# EAGLE design barometer (EAGLE 9.2.2)

## Sheet 1 of 9: Table of Contents
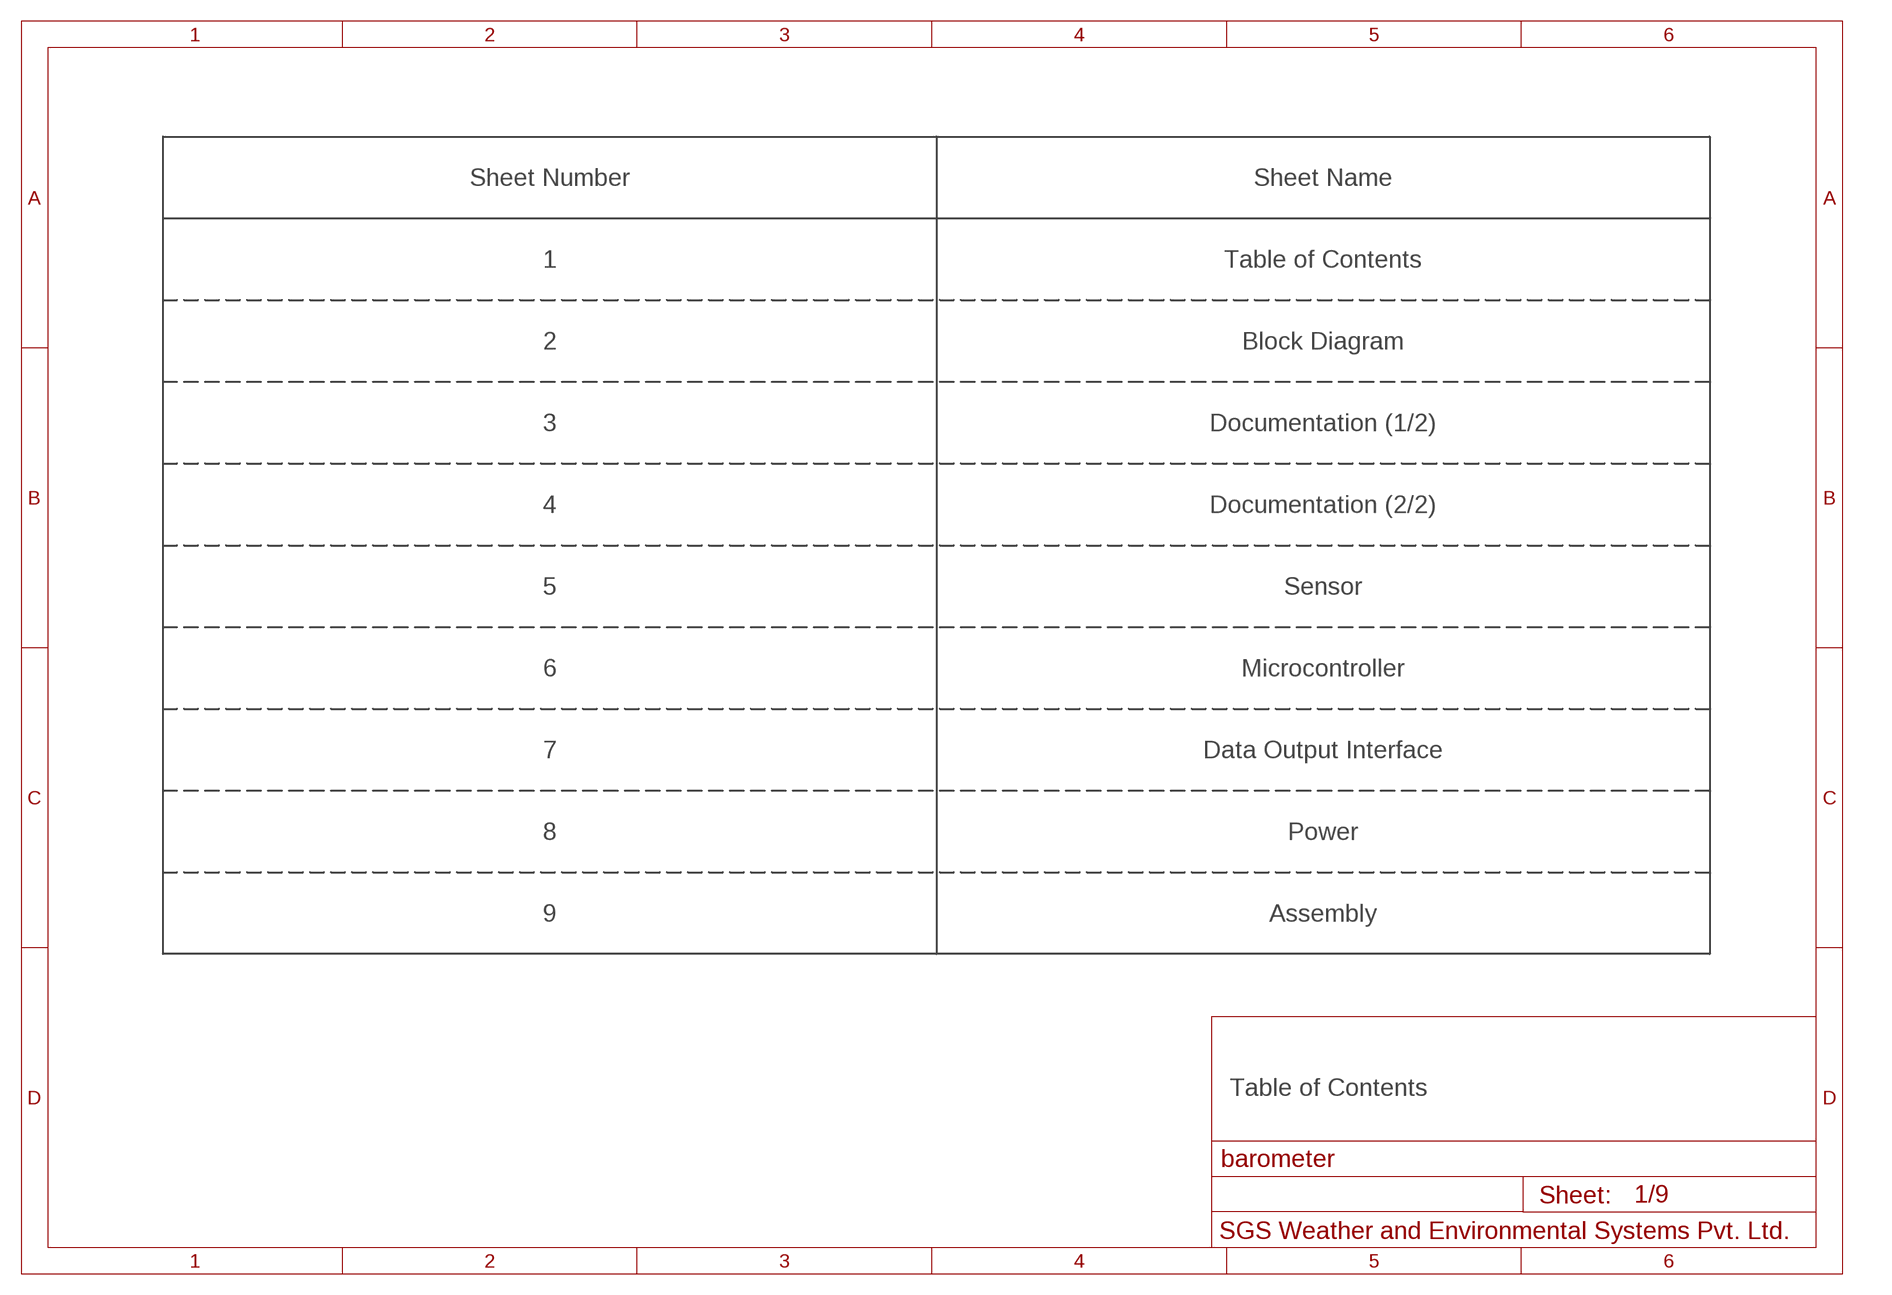
[diagram p0: schematic, sheet 1]

### Notes on the sheet
- Sheet Number | Sheet Name
- 1 | Table of Contents
- 2 | Block Diagram
- 3 | Documentation (1/2)
- 4 | Documentation (2/2)
- 5 | Sensor
- 6 | Microcontroller
- 7 | Data Output Interface
- 8 | Power
- 9 | Assembly
- Table of Contents

## Sheet 2 of 9: Block Diagram
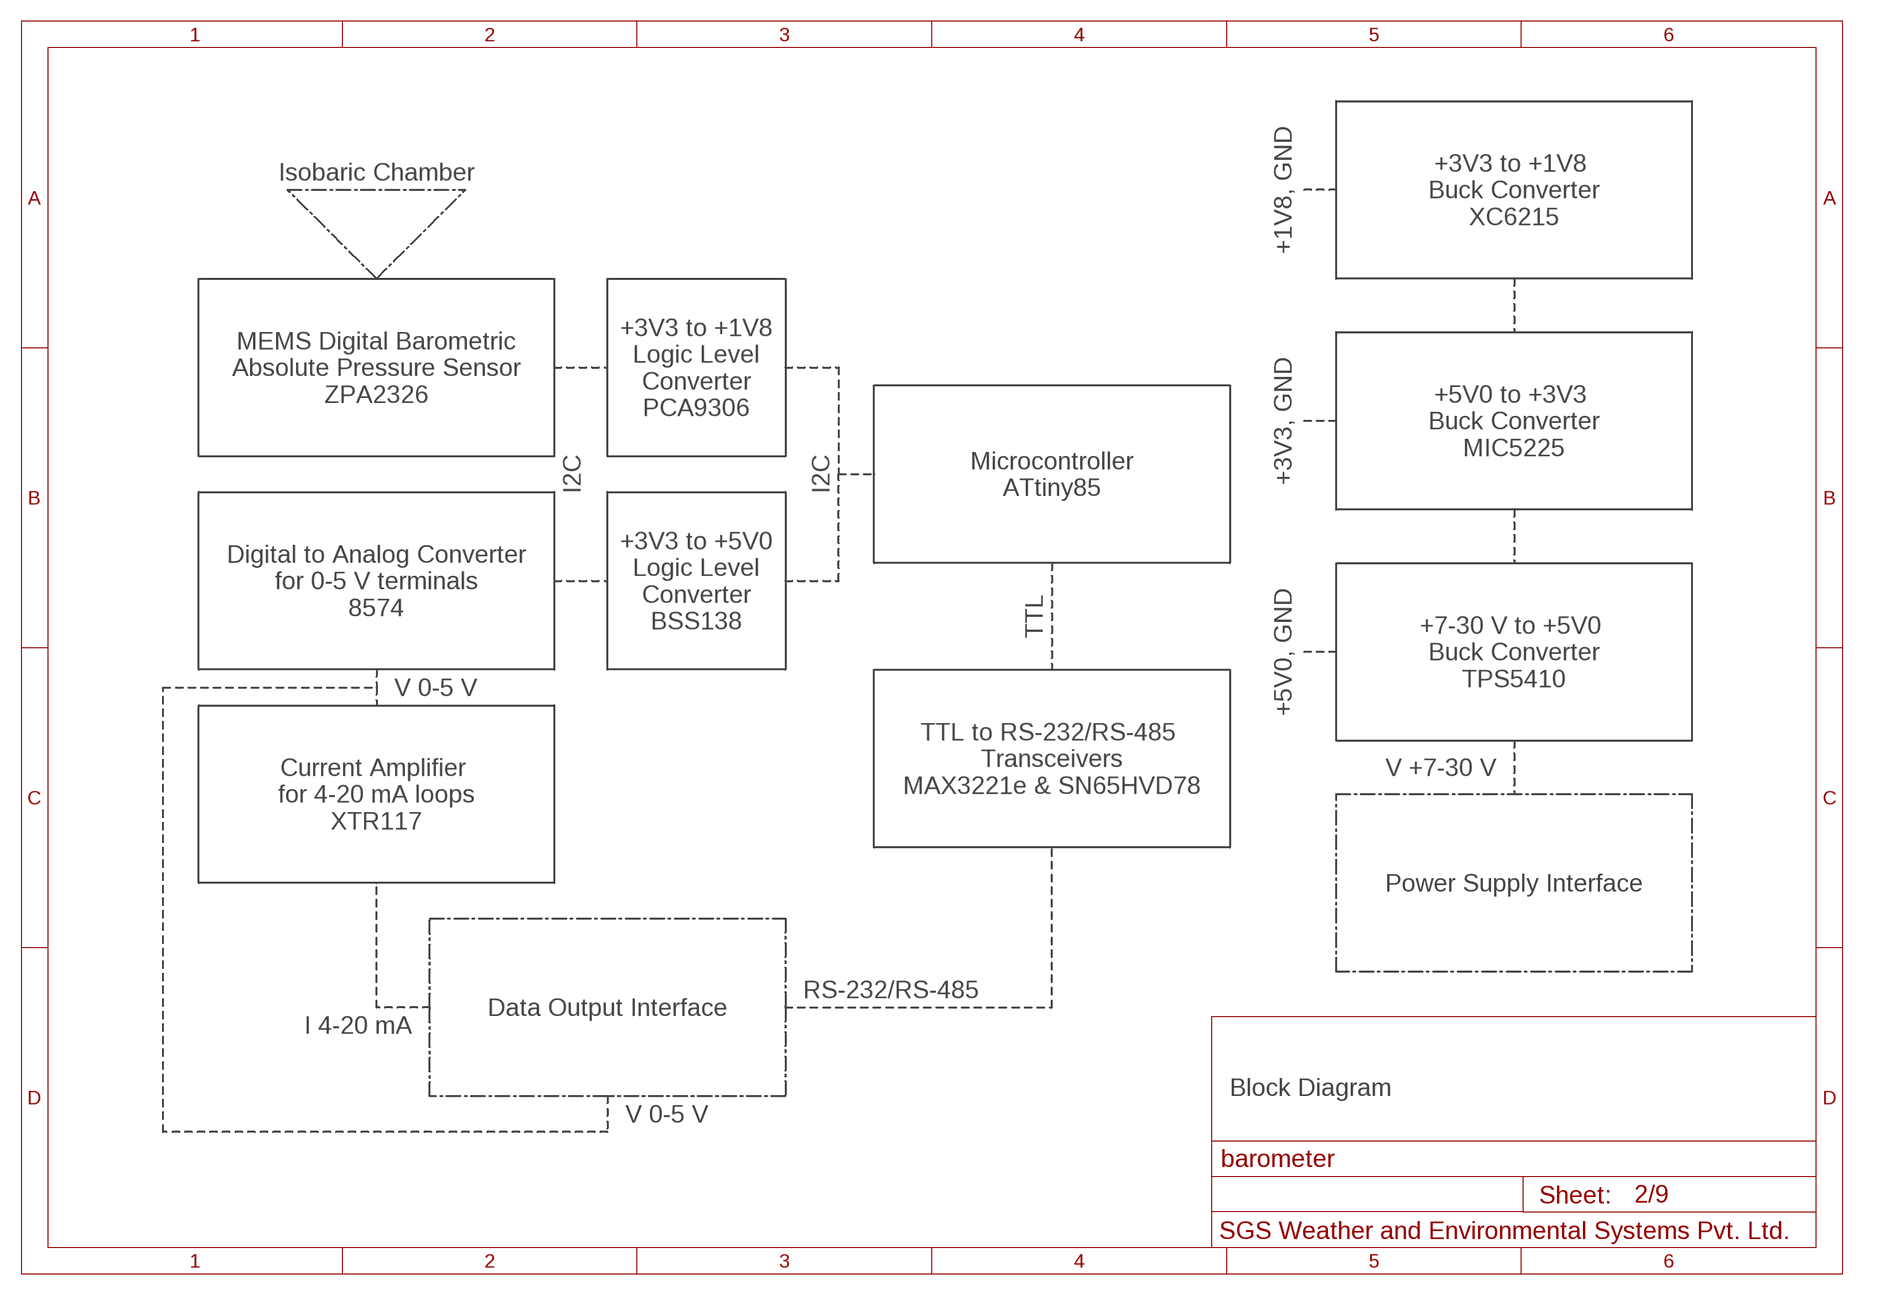
[diagram p1: schematic, sheet 2]

### Notes on the sheet
- Isobaric Chamber
- +1V8, GND
- +3V3 to +1V8 
  Buck Converter
  XC6215
- MEMS Digital Barometric
  Absolute Pressure Sensor
  ZPA2326
- +3V3 to +1V8
  Logic Level
  Converter
  PCA9306
- +3V3, GND
- +5V0 to +3V3 
  Buck Converter
  MIC5225
- I2C | I2C
- Microcontroller
  ATtiny85
- Digital to Analog Converter
  for 0-5 V terminals
  8574
- +3V3 to +5V0
  Logic Level
  Converter
  BSS138
- TTL
- +5V0, GND
- +7-30 V to +5V0 
  Buck Converter
  TPS5410
- V 0-5 V
- TTL to RS-232/RS-485 
  Transceivers
  MAX3221e & SN65HVD78
- V +7-30 V
- Current Amplifier 
  for 4-20 mA loops
  XTR117
- Power Supply Interface
- RS-232/RS-485
- Data Output Interface
- I 4-20 mA
- Block Diagram
- V 0-5 V

## Sheet 3 of 9: Documentation
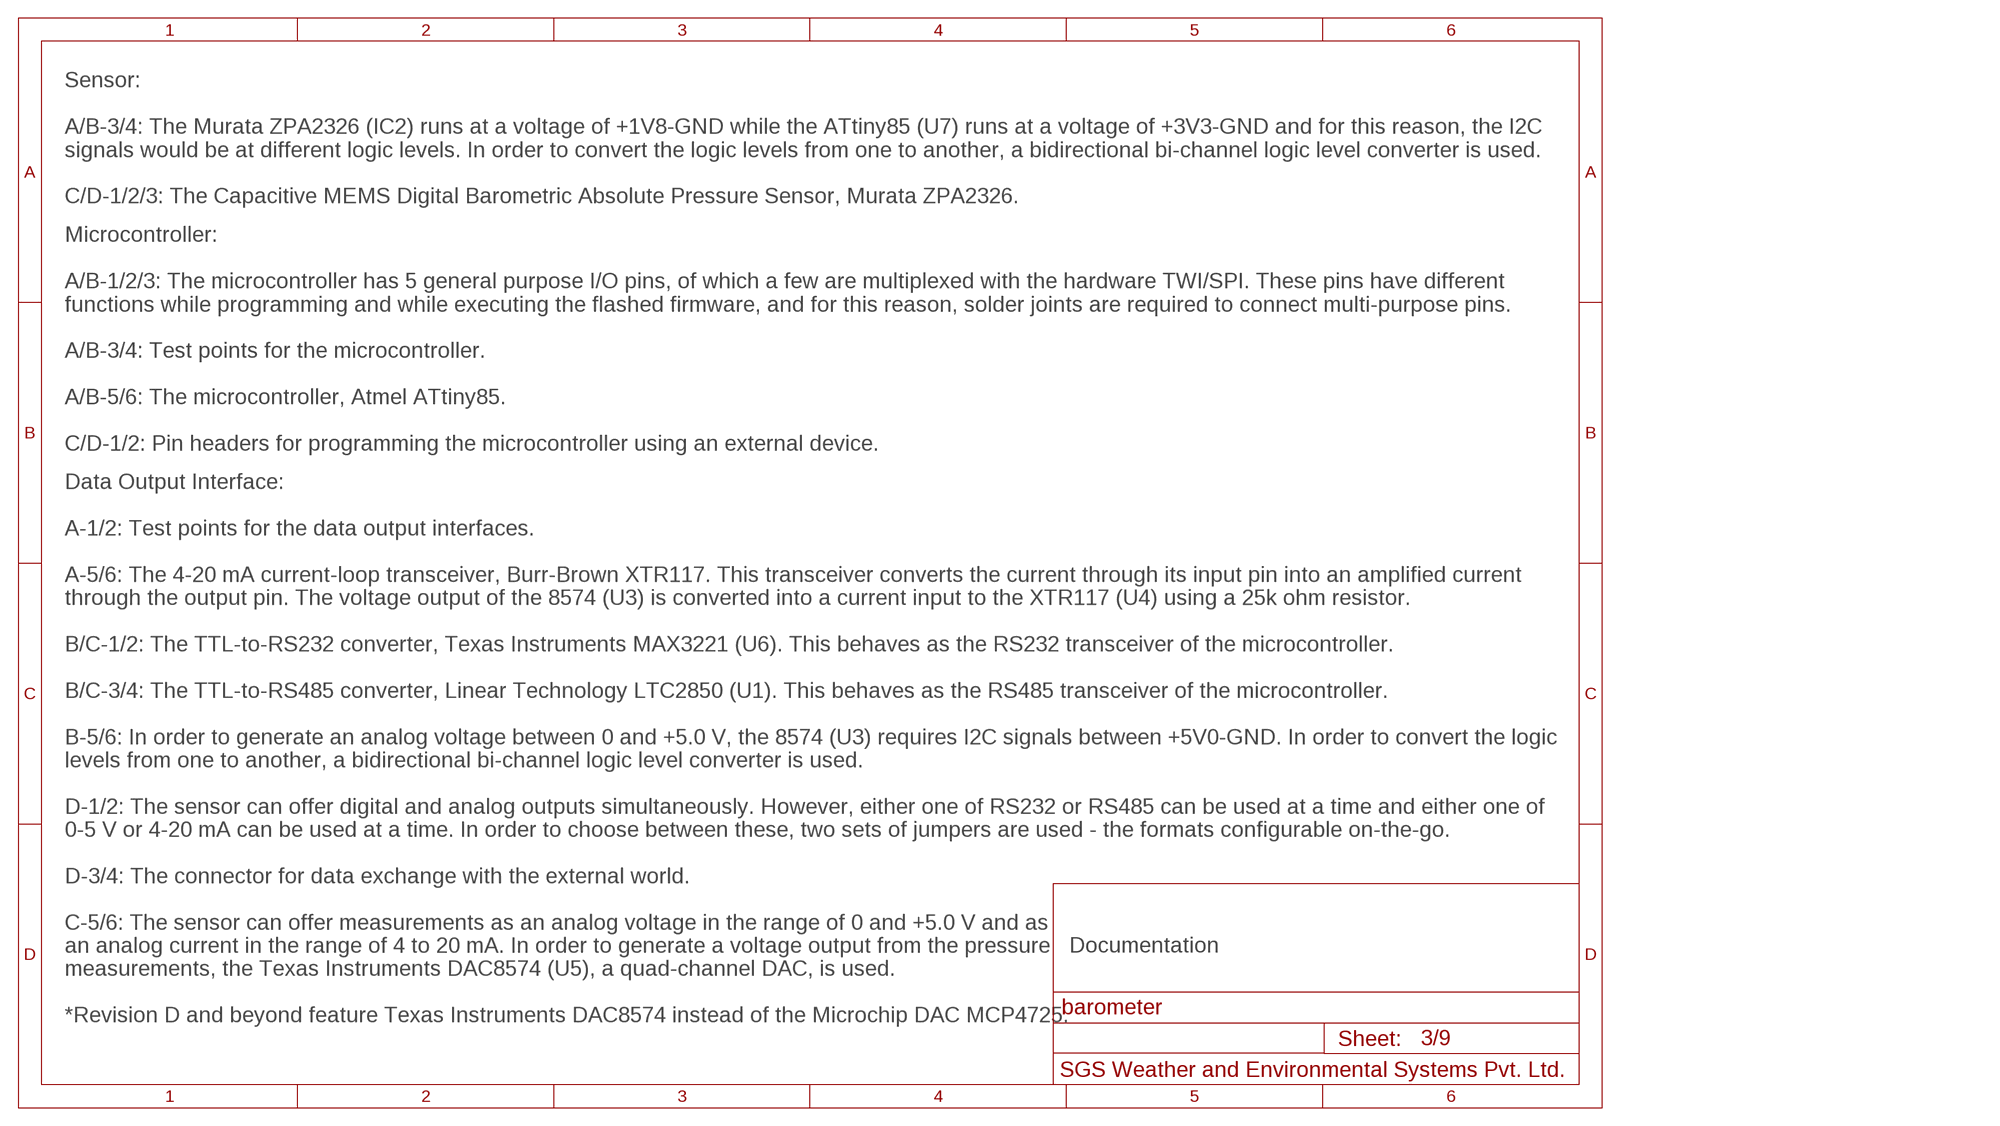
[diagram p2: schematic, sheet 3]

### Notes on the sheet
- Sensor:
  
  A/B-3/4: The Murata ZPA2326 (IC2) runs at a voltage of +1V8-GND while the ATtiny85 (U7) runs at a voltage of +3V3-GND and for this reason, the I2C 
  signals would be at different logic levels. In order to convert the logic levels from one to another, a bidirectional bi-channel logic level converter is used.
  
  C/D-1/2/3: The Capacitive MEMS Digital Barometric Absolute Pressure Sensor, Murata ZPA2326.
- Microcontroller:
  
  A/B-1/2/3: The microcontroller has 5 general purpose I/O pins, of which a few are multiplexed with the hardware TWI/SPI. These pins have different 
  functions while programming and while executing the flashed firmware, and for this reason, solder joints are required to connect multi-purpose pins.
  
  A/B-3/4: Test points for the microcontroller.
  
  A/B-5/6: The microcontroller, Atmel ATtiny85.
  
  C/D-1/2: Pin headers for programming the microcontroller using an external device.
- Data Output Interface:
  
  A-1/2: Test points for the data output interfaces.
  
  A-5/6: The 4-20 mA current-loop transceiver, Burr-Brown XTR117. This transceiver converts the current through its input pin into an amplified current 
  through the output pin. The voltage output of the 8574 (U3) is converted into a current input to the XTR117 (U4) using a 25k ohm resistor.
  
  B/C-1/2: The TTL-to-RS232 converter, Texas Instruments MAX3221 (U6). This behaves as the RS232 transceiver of the microcontroller.
  
  B/C-3/4: The TTL-to-RS485 converter, Linear Technology LTC2850 (U1). This behaves as the RS485 transceiver of the microcontroller.
  
  B-5/6: In order to generate an analog voltage between 0 and +5.0 V, the 8574 (U3) requires I2C signals between +5V0-GND. In order to convert the logic 
  levels from one to another, a bidirectional bi-channel logic level converter is used.
  
  D-1/2: The sensor can offer digital and analog outputs simultaneously. However, either one of RS232 or RS485 can be used at a time and either one of 
  0-5 V or 4-20 mA can be used at a time. In order to choose between these, two sets of jumpers are used - the formats configurable on-the-go.
  
  D-3/4: The connector for data exchange with the external world.
  
  C-5/6: The sensor can offer measurements as an analog voltage in the range of 0 and +5.0 V and as 
  an analog current in the range of 4 to 20 mA. In order to generate a voltage output from the pressure 
  measurements, the Texas Instruments DAC8574 (U5), a quad-channel DAC, is used.
  
  *Revision D and beyond feature Texas Instruments DAC8574 instead of the Microchip DAC MCP4725.
- Documentation

## Sheet 4 of 9: Documentation
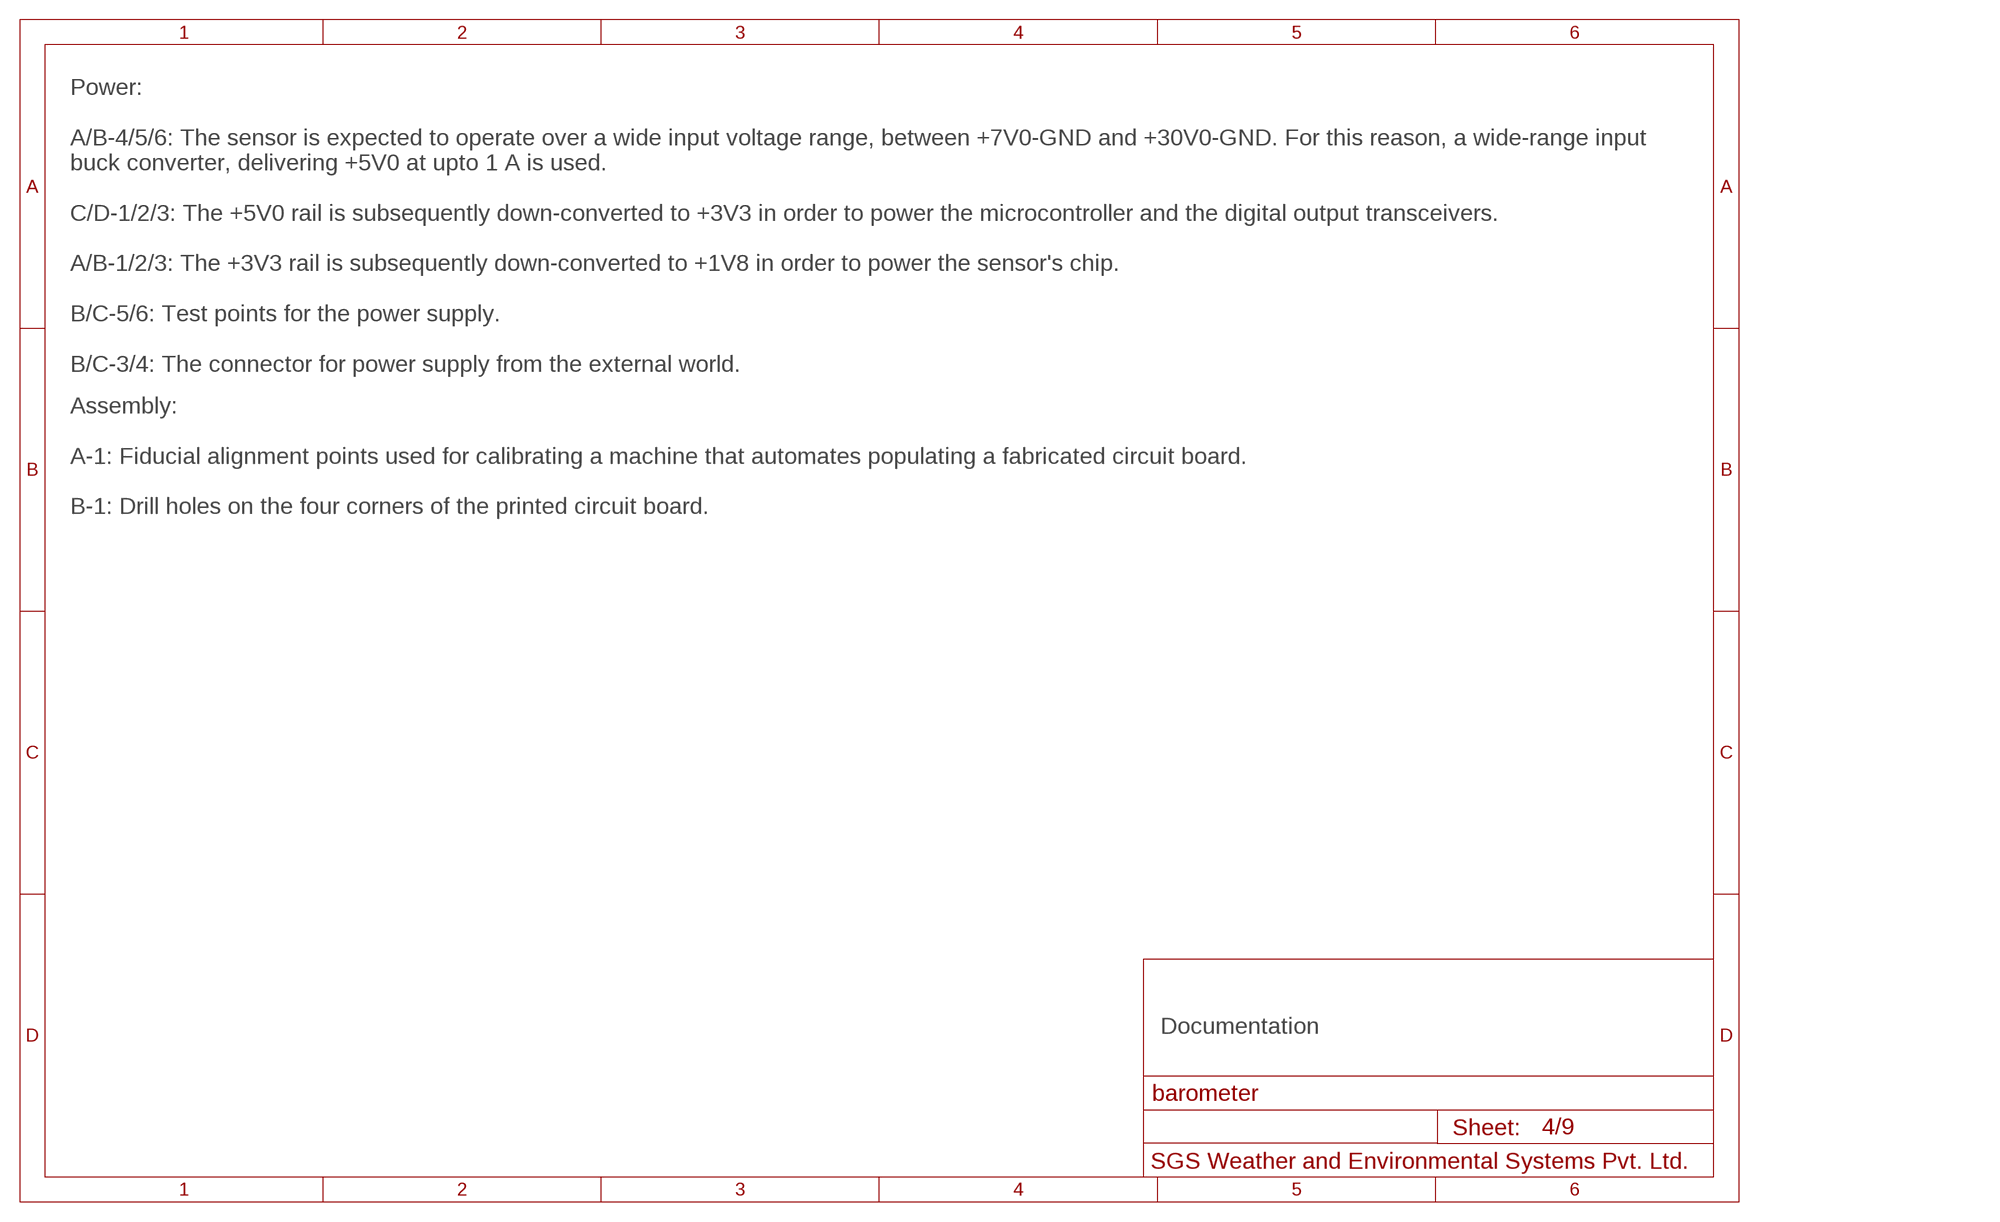
[diagram p3: schematic, sheet 4]

### Notes on the sheet
- Power:
  
  A/B-4/5/6: The sensor is expected to operate over a wide input voltage range, between +7V0-GND and +30V0-GND. For this reason, a wide-range input 
  buck converter, delivering +5V0 at upto 1 A is used.
  
  C/D-1/2/3: The +5V0 rail is subsequently down-converted to +3V3 in order to power the microcontroller and the digital output transceivers.
  
  A/B-1/2/3: The +3V3 rail is subsequently down-converted to +1V8 in order to power the sensor's chip.
  
  B/C-5/6: Test points for the power supply.
  
  B/C-3/4: The connector for power supply from the external world.
- Assembly:
  
  A-1: Fiducial alignment points used for calibrating a machine that automates populating a fabricated circuit board.
  
  B-1: Drill holes on the four corners of the printed circuit board.
- Documentation

## Sheet 5 of 9: Sensor
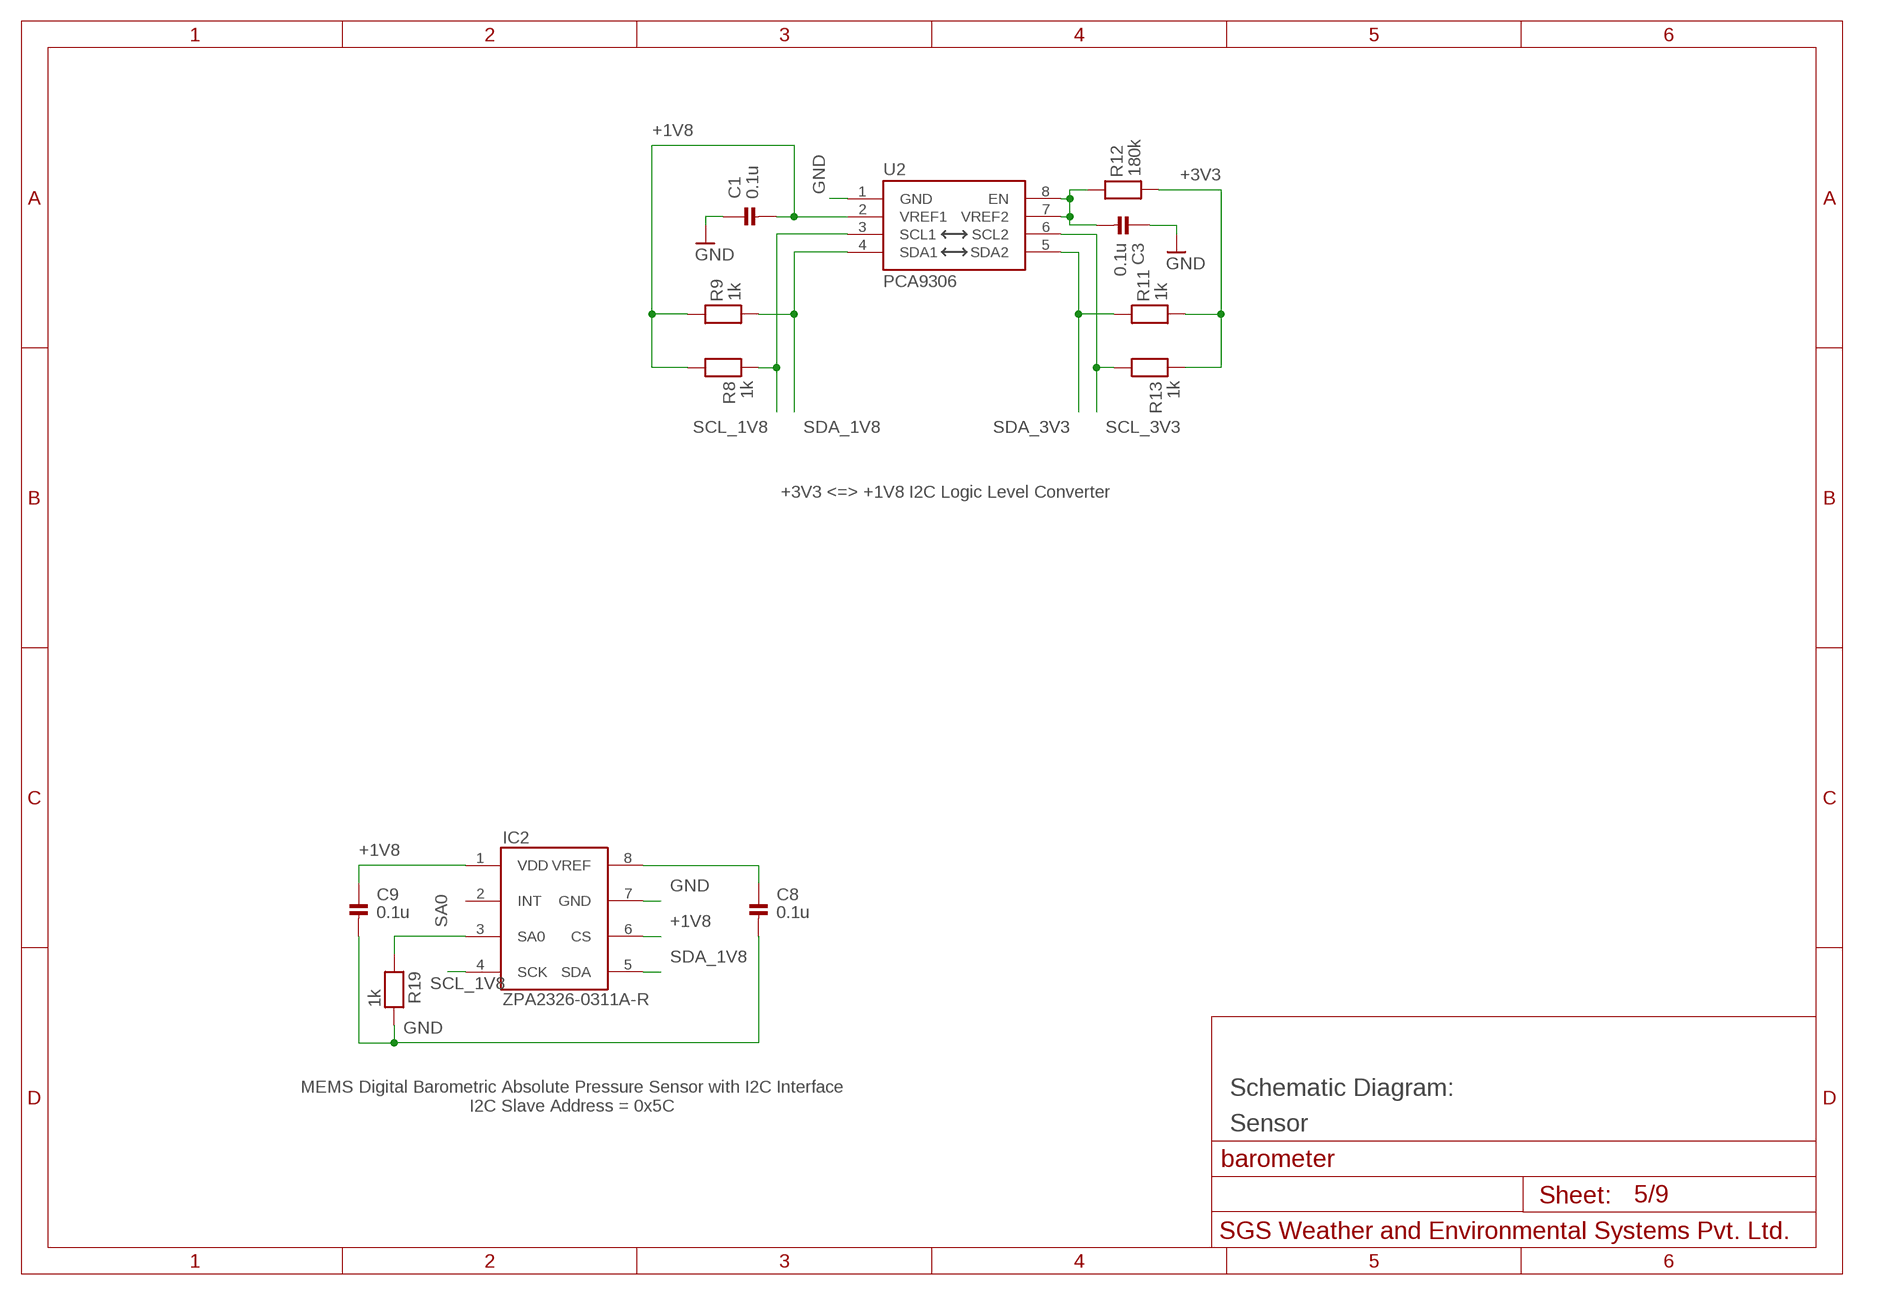
[diagram p4: schematic, sheet 5]

### Parts
C1  0.1u  CAP_CERAMIC0603  [0603]
C3  0.1u  CAP_CERAMIC0603  [0603]
C8  0.1u  CAP_CERAMIC0603  [0603]
C9  0.1u  CAP_CERAMIC0603  [0603]
IC2  ZPA2326-0311A-R  [2326]
R8  1k  RESISTOR0603  [0603]
R9  1k  RESISTOR0603  [0603]
R11  1k  RESISTOR0603  [0603]
R12  180k  RESISTOR0603  [0603]
R13  1k  RESISTOR0603  [0603]
R19  1k  RESISTOR0603  [0603]
U2  PCA9306  [PSOP-8]

### Nets
+1V8: C1.2 C9.1 IC2.1(VDD) IC2.6(CS) R8.2 R9.2 U2.2(VREF1) ; also sheet 8
+3V3: R11.1 R12.1 R13.1 ; also sheet 6,7,8
GND: C1.1 C3.1 C8.2 C9.2 IC2.7(GND) R19.2 U2.1(GND) ; also sheet 6,7,8
SA0: IC2.3(SA0) R19.1
SCL_1V8: IC2.4(SCK) R8.1 U2.3(SCL1)
SCL_3V3: R13.2 U2.6(SCL2) ; also sheet 6,7
SDA_1V8: IC2.5(SDA) R9.1 U2.4(SDA1)
SDA_3V3: R11.2 U2.5(SDA2) ; also sheet 6,7
VREF: C8.1 IC2.8(VREF)
VREF_3V3: C3.2 R12.2 U2.7(VREF2) U2.8(EN)
Unconnected: IC2.2(INT)

### Notes on the sheet
- +3V3 <=> +1V8 I2C Logic Level Converter
- MEMS Digital Barometric Absolute Pressure Sensor with I2C Interface
  I2C Slave Address = 0x5C
- Schematic Diagram:
- Sensor

## Sheet 6 of 9: Microcontroller
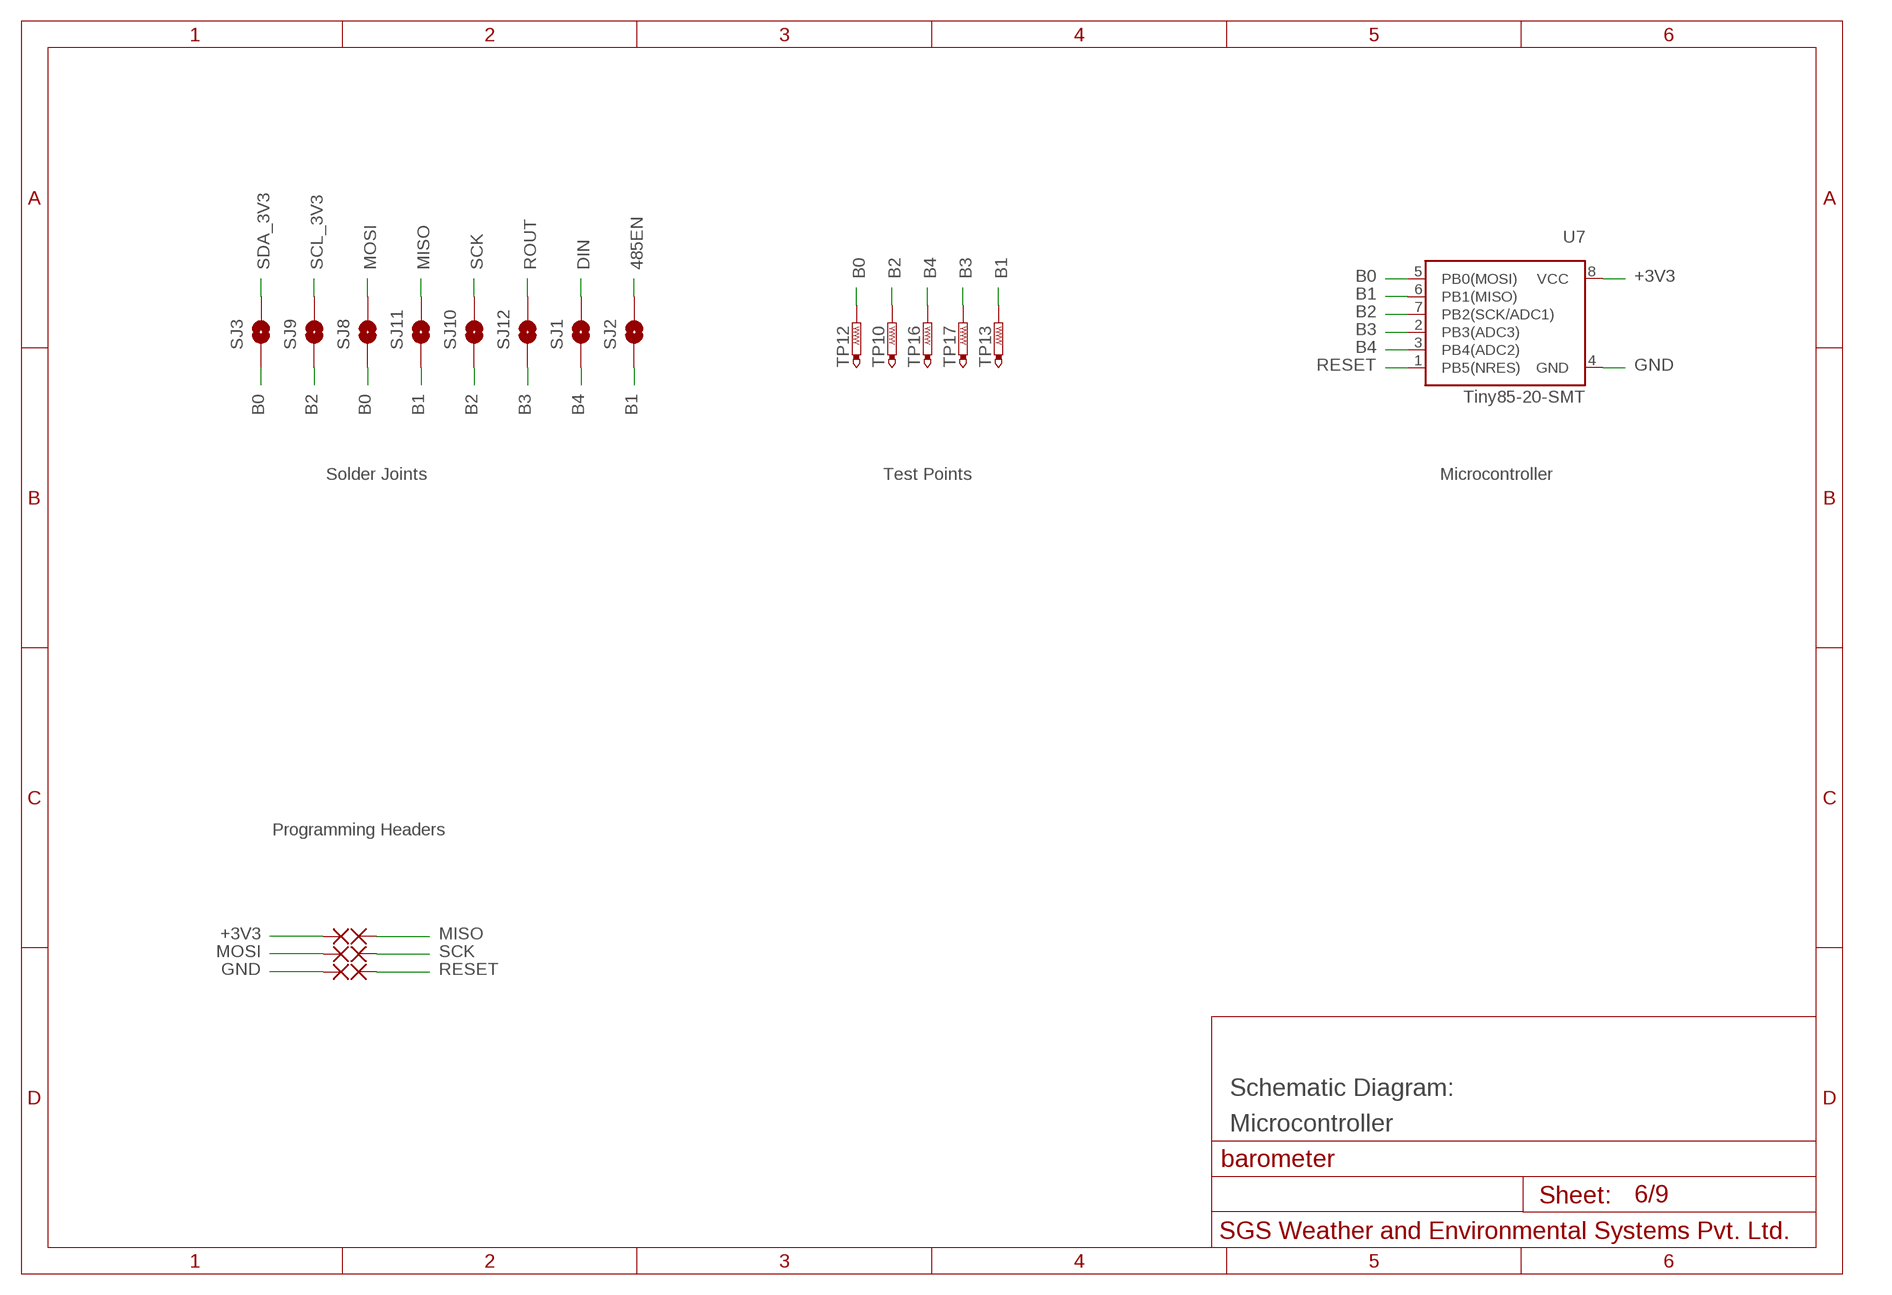
[diagram p5: schematic, sheet 6]

### Parts
PAD1  SMD2  [SMD1,27-2,54]
PAD2  SMD2  [SMD1,27-2,54]
PAD3  SMD2  [SMD1,27-2,54]
PAD4  SMD2  [SMD1,27-2,54]
PAD5  SMD2  [SMD1,27-2,54]
PAD6  SMD2  [SMD1,27-2,54]
SJ1  SOLDERJUMPERTRACE  [SJ_2S-TRACE]
SJ2  SOLDERJUMPERTRACE  [SJ_2S-TRACE]
SJ3  SOLDERJUMPERNO  [SJ_2S-NO]
SJ8  SOLDERJUMPERTRACE  [SJ_2S-TRACE]
SJ9  SOLDERJUMPERTRACE  [SJ_2S-TRACE]
SJ10  SOLDERJUMPERTRACE  [SJ_2S-TRACE]
SJ11  SOLDERJUMPERTRACE  [SJ_2S-TRACE]
SJ12  SOLDERJUMPERTRACE  [SJ_2S-TRACE]
TP10  PTR1B1,27  [B1,27]
TP12  PTR1B1,27  [B1,27]
TP13  PTR1B1,27  [B1,27]
TP16  PTR1B1,27  [B1,27]
TP17  PTR1B1,27  [B1,27]
U7  Tiny85-20-SMT  ATTINY45TINY85-20-SMT  [SO08-EIAJ_MCU]

### Nets
485EN: SJ2.2 ; also sheet 7
+3V3: PAD2.1(P) U7.8(VCC) ; also sheet 5,7,8
B0: SJ3.1 SJ8.1 TP12.TP U7.5(PB0(MOSI))
B1: SJ2.1 SJ11.1 TP13.TP U7.6(PB1(MISO))
B2: SJ9.1 SJ10.1 TP10.TP U7.7(PB2(SCK/ADC1))
B3: SJ12.1 TP17.TP U7.2(PB3(ADC3))
B4: SJ1.1 TP16.TP U7.3(PB4(ADC2))
DIN: SJ1.2 ; also sheet 7
GND: PAD6.1(P) U7.4(GND) ; also sheet 5,7,8
MISO: PAD1.1(P) SJ11.2
MOSI: PAD4.1(P) SJ8.2
RESET: PAD5.1(P) U7.1(PB5(NRES))
ROUT: SJ12.2 ; also sheet 7
SCK: PAD3.1(P) SJ10.2
SCL_3V3: SJ9.2 ; also sheet 5,7
SDA_3V3: SJ3.2 ; also sheet 5,7

### Notes on the sheet
- Solder Joints | Test Points | Microcontroller
- Programming Headers
- Schematic Diagram:
- Microcontroller

## Sheet 7 of 9: Data Output Interface
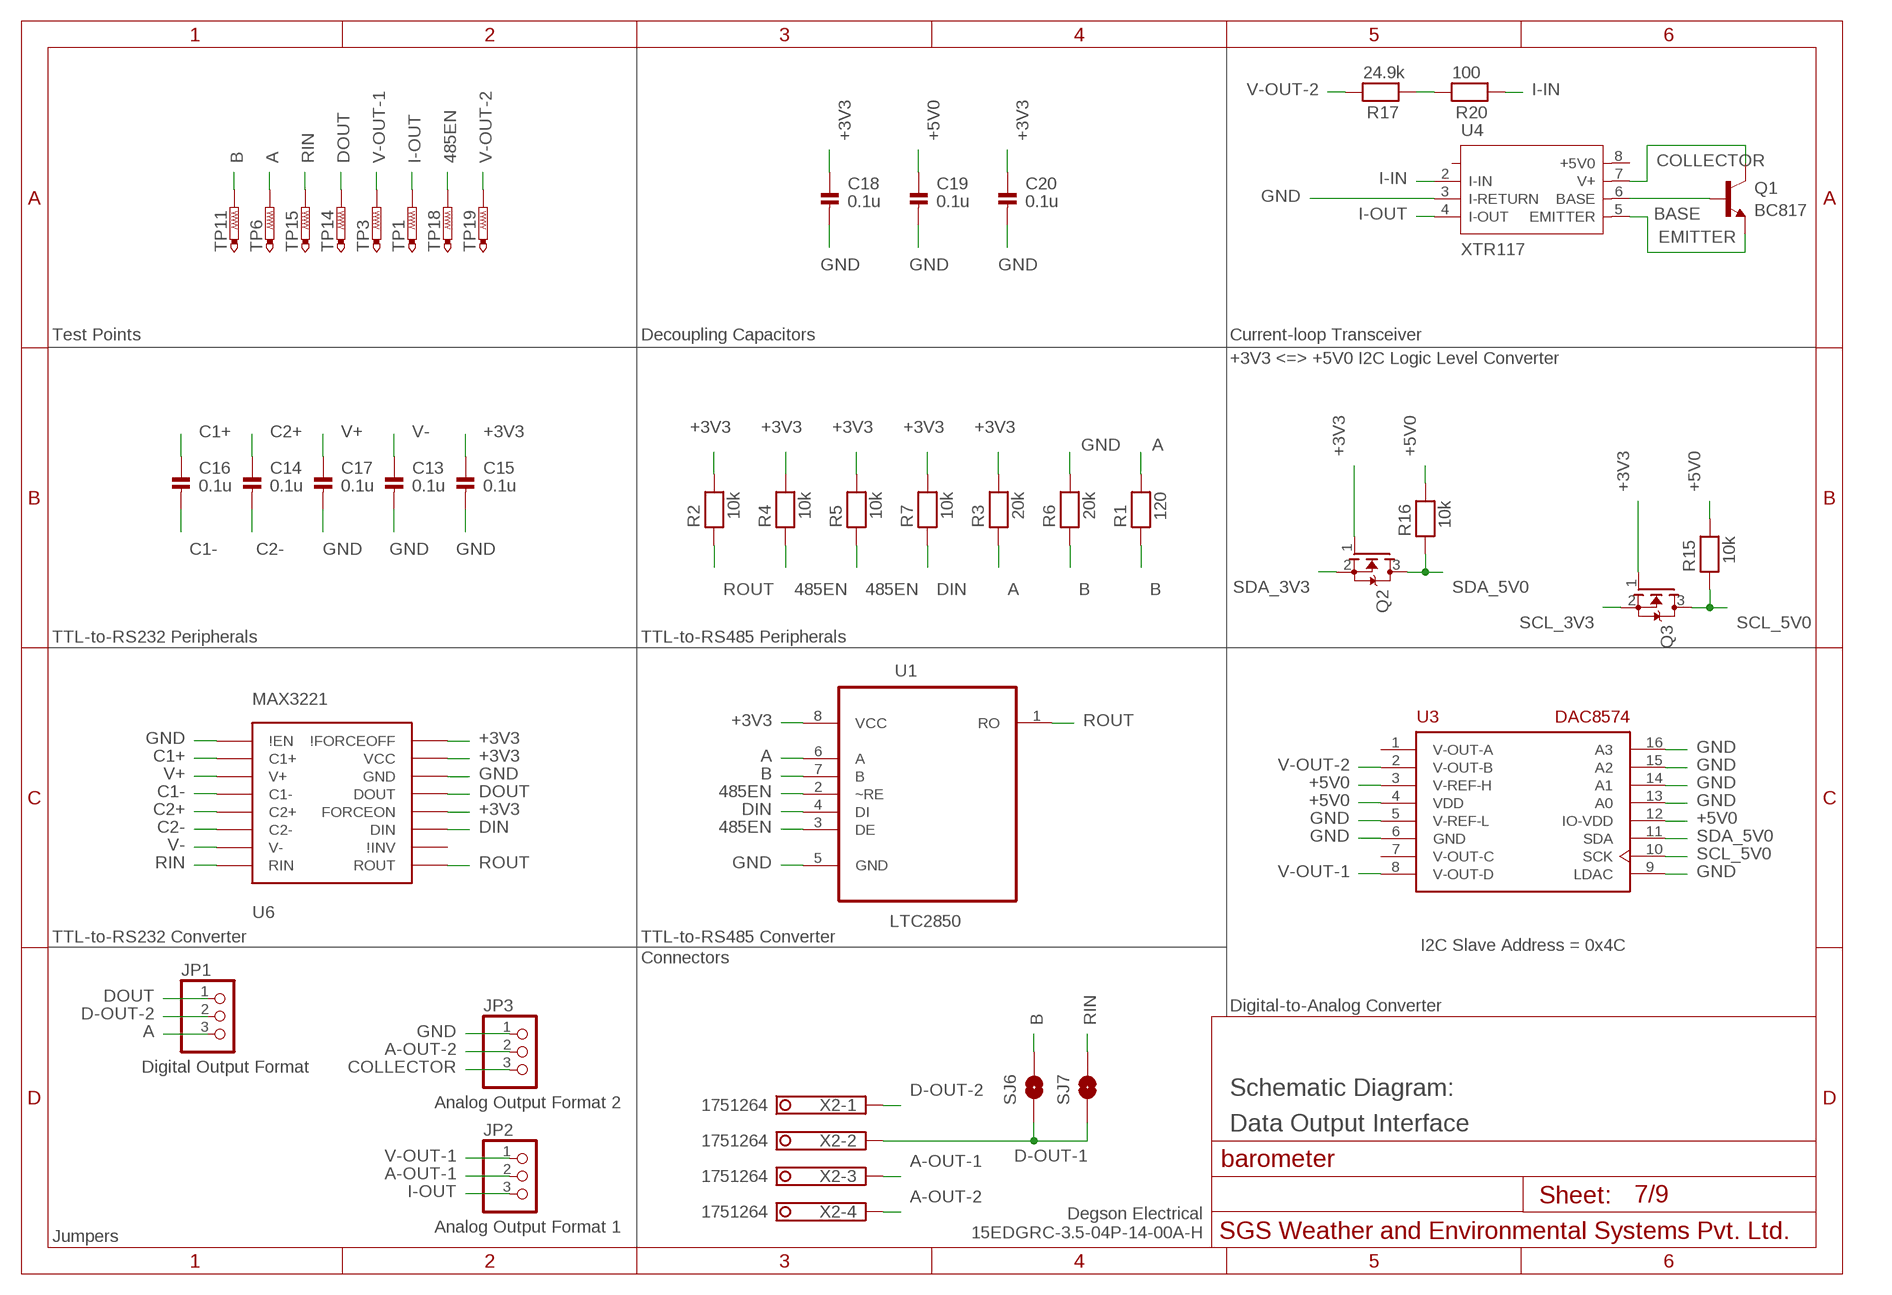
[diagram p6: schematic, sheet 7]

### Parts
C13  0.1u  CAP_CERAMIC0603  [0603]
C14  0.1u  CAP_CERAMIC0603  [0603]
C15  0.1u  CAP_CERAMIC0603  [0603]
C16  0.1u  CAP_CERAMIC0603  [0603]
C17  0.1u  CAP_CERAMIC0603  [0603]
C18  0.1u  CAP_CERAMIC0603  [0603]
C19  0.1u  CAP_CERAMIC0603  [0603]
C20  0.1u  CAP_CERAMIC0603  [0603]
JP1  Digital Output Format  HEADER-1X3SMT  [1X03_SMT]
JP2  Analog Output Format 1  HEADER-1X3SMT  [1X03_SMT]
JP3  Analog Output Format 2  HEADER-1X3SMT  [1X03_SMT]
Q1  BC817  TRANSISTOR_NPNWIDE  [SOT23-WIDE]
Q2  MOSFET-NWIDE  [SOT23-WIDE]
Q3  MOSFET-NWIDE  [SOT23-WIDE]
R1  120  RESISTOR0603  [0603]
R2  10k  RESISTOR0603  [0603]
R3  20k  RESISTOR0603  [0603]
R4  10k  RESISTOR0603  [0603]
R5  10k  RESISTOR0603  [0603]
R6  20k  RESISTOR0603  [0603]
R7  10k  RESISTOR0603  [0603]
R15  10k  RESISTOR0603  [0603]
R16  10k  RESISTOR0603  [0603]
R17  24.9k  RESISTOR0603  [0603]
R20  100  RESISTOR0603  [0603]
SJ6  SOLDERJUMPERTRACE  [SJ_2S-TRACE]
SJ7  SOLDERJUMPERTRACE  [SJ_2S-TRACE]
TP1  PTR1B1,27  [B1,27]
TP3  PTR1B1,27  [B1,27]
TP6  PTR1B1,27  [B1,27]
TP11  PTR1B1,27  [B1,27]
TP14  PTR1B1,27  [B1,27]
TP15  PTR1B1,27  [B1,27]
TP18  PTR1B1,27  [B1,27]
TP19  PTR1B1,27  [B1,27]
U1  LTC2850  LTC2850IS8PBF  [SOIC127P600X175-8N]
U3  DAC8574  [TSSOP16]
U4  XTR117  TRANSCEIVER-XTR117  [MSOP8-0.65-3X3MM]
U6  MAX3221  MAX3221-TSSOP16  [TSSOP16]
X2  1751264  [1751264]

### Nets
485EN: R4.1 R5.1 TP18.TP U1.2(~RE) U1.3(DE) ; also sheet 6
+3V3: C15.1 C18.1 C20.1 Q2.1(G) Q3.1(G) R2.2 R3.2 R4.2 R5.2 R7.2 U1.8(VCC) U6.12(FORCEON) U6.15(VCC) U6.16(\!FORCEOFF) ; also sheet 5,6,8
+5V0: C19.1 R15.2 R16.2 U3.3(V-REF-H) U3.4(VDD) U3.12(IO-VDD) ; also sheet 8
A: JP1.3 R1.2 R3.1 TP6.TP U1.6(A)
A-OUT-1: JP2.2 X2.3
A-OUT-2: JP3.2 X2.4
B: R1.1 R6.1 SJ6.2 TP11.TP U1.7(B)
BASE: Q1.1(B) U4.6(BASE)
C1+: C16.1 U6.2(C1+)
C1-: C16.2 U6.4(C1-)
C2+: C14.1 U6.5(C2+)
C2-: C14.2 U6.6(C2-)
COLLECTOR: JP3.3 Q1.3(C) U4.7(V+)
D-OUT-1: SJ6.1 SJ7.1 X2.2
D-OUT-2: JP1.2 X2.1
DIN: R7.1 U1.4(DI) U6.11(DIN) ; also sheet 6
DOUT: JP1.1 TP14.TP U6.13(DOUT)
EMITTER: Q1.2(E) U4.5(EMITTER)
GND: C13.2 C15.2 C17.2 C18.2 C19.2 C20.2 JP3.1 R6.2 U1.5(GND) U3.5(V-REF-L) U3.6(GND) U3.9(LDAC) U3.13(A0) U3.14(A1) U3.15(A2) U3.16(A3) U4.3(I-RETURN) U6.1(\!EN) U6.14(GND) ; also sheet 5,6,8
I-IN: R20.1 U4.2(I-IN)
I-OUT: JP2.3 TP1.TP U4.4(I-OUT)
MEZZANINE-1: R17.1 R20.2
RIN: SJ7.2 TP15.TP U6.8(RIN)
ROUT: R2.1 U1.1(RO) U6.9(ROUT) ; also sheet 6
SCL_3V3: Q3.2(S) ; also sheet 5,6
SCL_5V0: Q3.3(D) R15.1 U3.10(SCK)
SDA_3V3: Q2.2(S) ; also sheet 5,6
SDA_5V0: Q2.3(D) R16.1 U3.11(SDA)
V+: C17.1 U6.3(V+)
V-: C13.1 U6.7(V-)
V-OUT-1: JP2.1 TP3.TP U3.8(V-OUT-D)
V-OUT-2: R17.2 TP19.TP U3.2(V-OUT-B)
Unconnected: U3.1(V-OUT-A) U3.7(V-OUT-C) U4.8(+5V0) U6.10(\!INV)

### Notes on the sheet
- Test Points | Decoupling Capacitors | Current-loop Transceiver
- +3V3 <=> +5V0 I2C Logic Level Converter
- TTL-to-RS232 Peripherals | TTL-to-RS485 Peripherals
- TTL-to-RS232 Converter | TTL-to-RS485 Converter | I2C Slave Address = 0x4C
- Connectors
- Digital-to-Analog Converter
- Schematic Diagram:
- Data Output Interface
- Degson Electrical
  15EDGRC-3.5-04P-14-00A-H
- Jumpers

## Sheet 8 of 9: Power
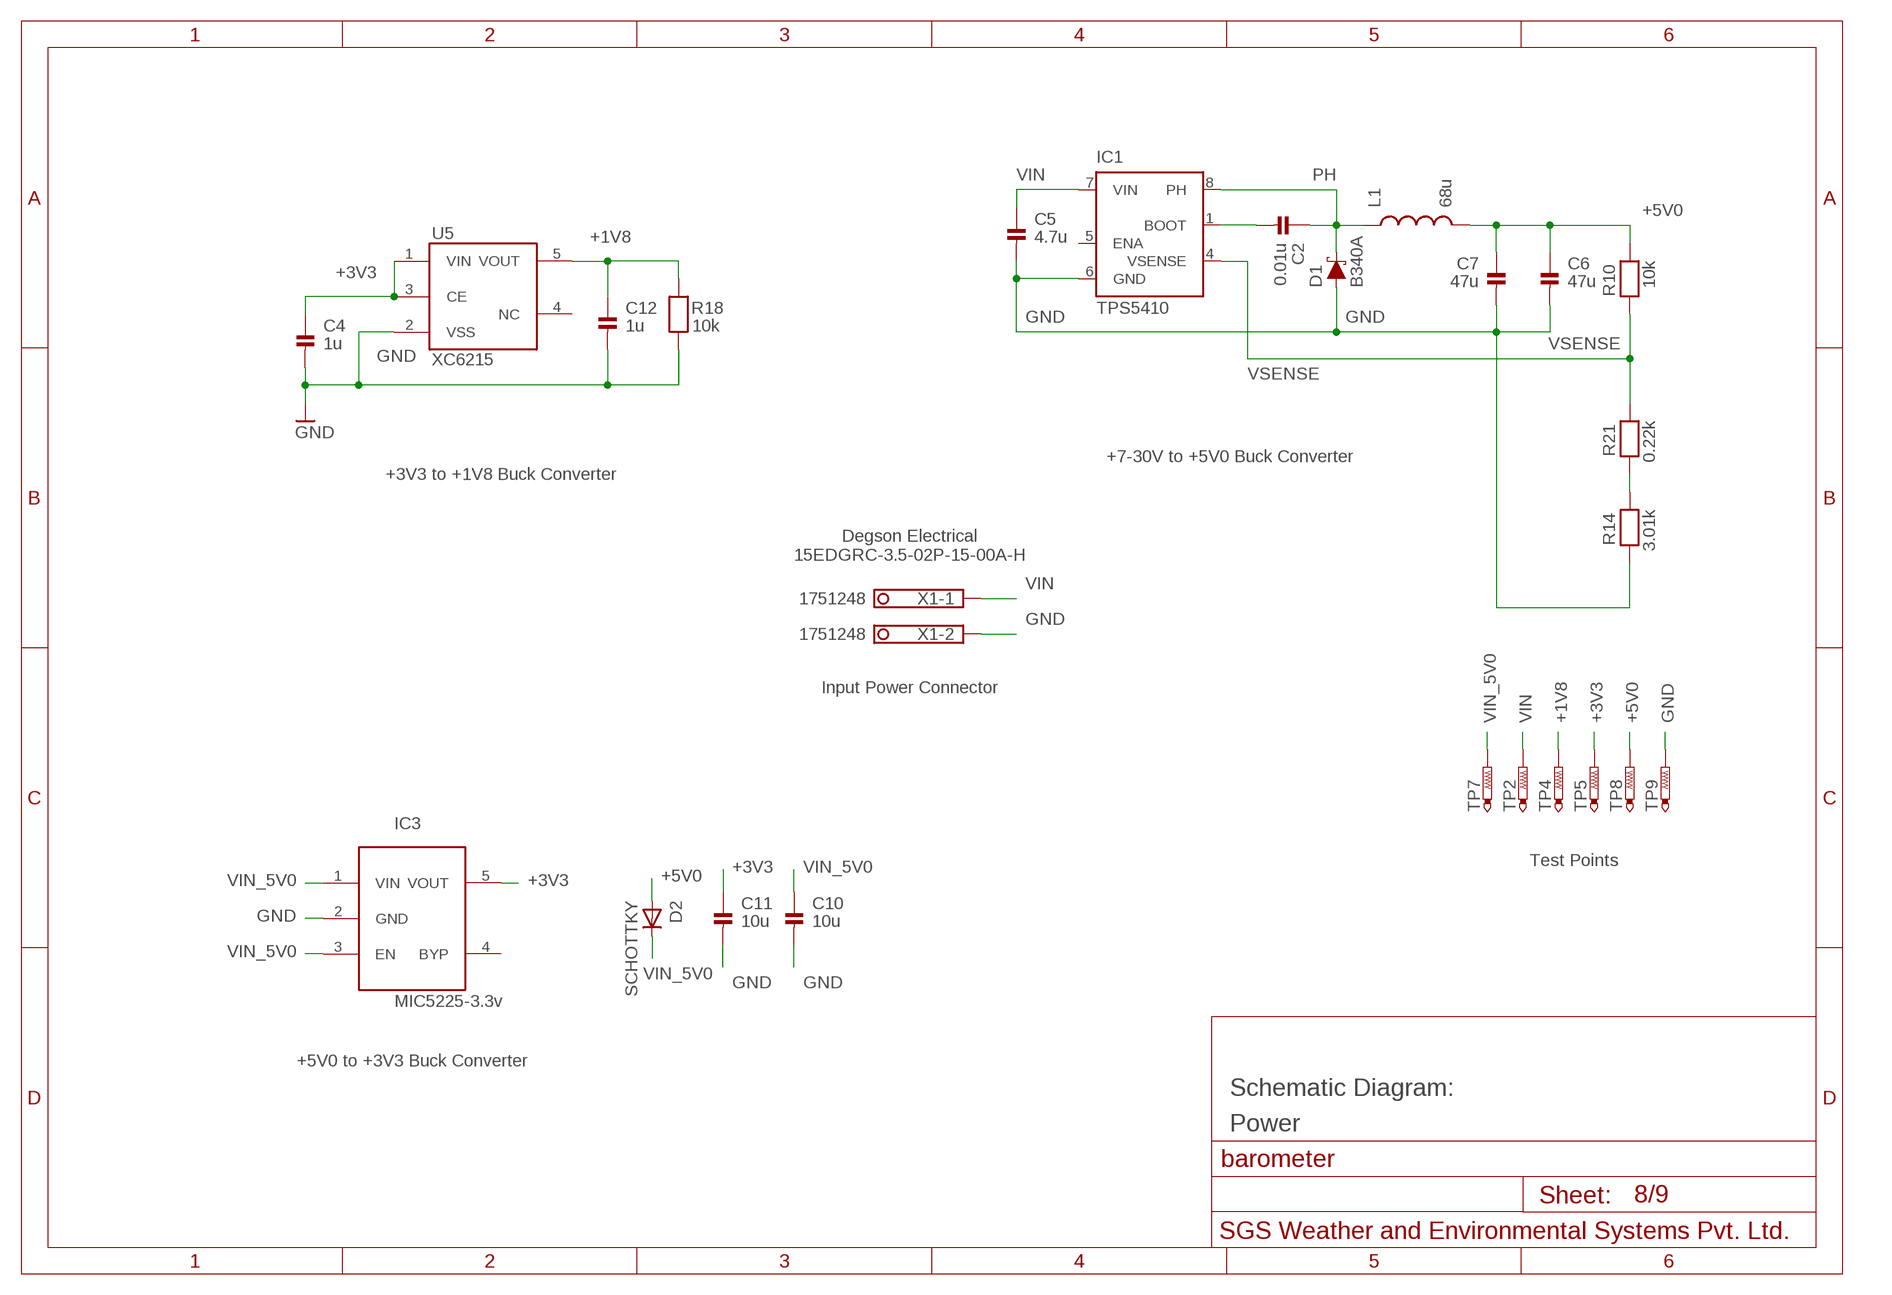
[diagram p7: schematic, sheet 8]

### Parts
C2  0.01u  CAP_CERAMIC0603  [0603]
C4  1u  CAP_CERAMIC0603  [0603]
C5  4.7u  CAP_CERAMIC0805  [0805]
C6  47u  CAP_CERAMIC1206  [1206]
C7  47u  CAP_CERAMIC1206  [1206]
C10  10u  CAP_CERAMIC0603  [0603]
C11  10u  CAP_CERAMIC0603  [0603]
C12  1u  CAP_CERAMIC0603  [0603]
D1  B340A  DIODE-SCHOTTKY-B340A  [SMA-DIODE]
D2  SCHOTTKY  DIODE_SOD-123FL  [SOD-123FL]
IC1  TPS5410  [D_R-PDSO-G08]
IC3  MIC5225-3.3v  LP298XS  [SOT23-5L]
L1  68u  INDUCTOR-TDKVLS6045EX  [VLS6045EX]
R10  10k  RESISTOR0603  [0603]
R14  3.01k  RESISTOR0603  [0603]
R18  10k  RESISTOR0603  [0603]
R21  0.22k  RESISTOR0603  [0603]
TP2  PTR1B1,27  [B1,27]
TP4  PTR1B1,27  [B1,27]
TP5  PTR1B1,27  [B1,27]
TP7  PTR1B1,27  [B1,27]
TP8  PTR1B1,27  [B1,27]
TP9  PTR1B1,27  [B1,27]
U5  XC6215XC6215B182NR  [SOT25]
X1  1751248  [1751248]

### Nets
+1V8: C12.1 R18.2 TP4.TP U5.5(VOUT) ; also sheet 5
+3V3: C4.1 C11.1 IC3.5(VOUT) TP5.TP U5.1(VIN) U5.3(CE) ; also sheet 5,6,7
+5V0: C6.1 C7.1 D2.A L1.2 R10.2 TP8.TP ; also sheet 7
BOOT: C2.2 IC1.1(BOOT)
GND: C4.2 C5.2 C6.2 C7.2 C10.2 C11.2 C12.2 D1.A IC1.6(GND) IC3.2(GND) R14.1 R18.1 TP9.TP U5.2(VSS) X1.2 ; also sheet 5,6,7
N$1: R14.2 R21.1
PH: C2.1 D1.C IC1.8(PH) L1.1
VIN: C5.1 IC1.7(VIN) TP2.TP X1.1
VIN_5V0: C10.1 D2.C IC3.1(VIN) IC3.3(EN) TP7.TP
VSENSE: IC1.4(VSENSE) R10.1 R21.2
Unconnected: IC1.5(ENA) IC3.4(BYP) U5.4(NC)

### Notes on the sheet
- +7-30V to +5V0 Buck Converter
- +3V3 to +1V8 Buck Converter
- Degson Electrical
  15EDGRC-3.5-02P-15-00A-H
- Input Power Connector
- Test Points
- +5V0 to +3V3 Buck Converter
- Schematic Diagram:
- Power

## Sheet 9 of 9: Assembly
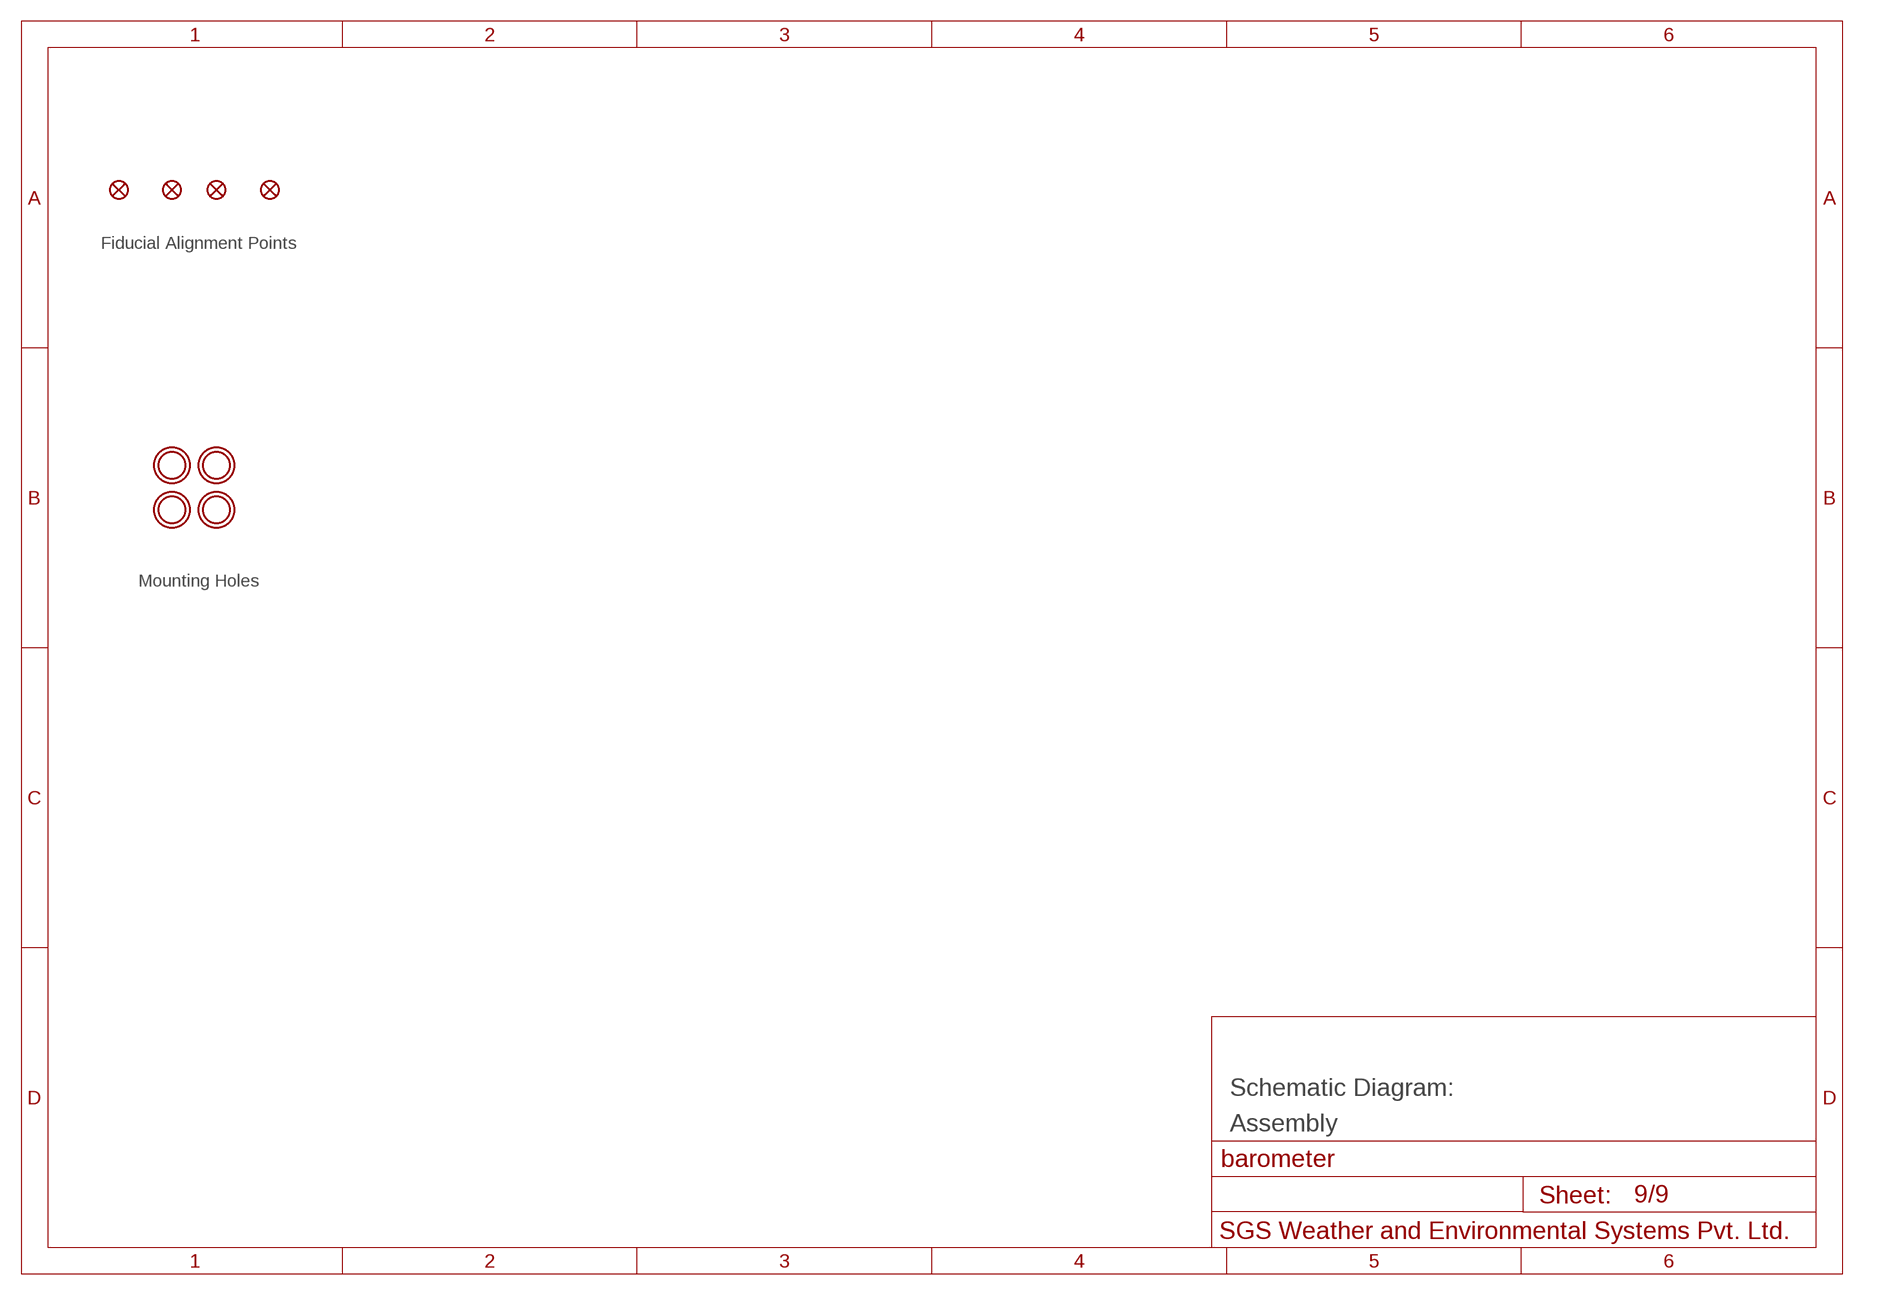
[diagram p8: schematic, sheet 9]

### Parts
FID1  FIDUCIAL1X2.5  [FIDUCIAL-1X2.5]
FID2  FIDUCIAL1X2.5  [FIDUCIAL-1X2.5]
FID3  FIDUCIAL1X2.5  [FIDUCIAL-1X2.5]
FID4  FIDUCIAL1X2.5  [FIDUCIAL-1X2.5]
U$1  MOUNTINGHOLE2.75  [MOUNTINGHOLE_2.75_PLATED]
U$2  MOUNTINGHOLE2.75  [MOUNTINGHOLE_2.75_PLATED]
U$3  MOUNTINGHOLE2.75  [MOUNTINGHOLE_2.75_PLATED]
U$4  MOUNTINGHOLE2.75  [MOUNTINGHOLE_2.75_PLATED]

### Notes on the sheet
- Fiducial Alignment Points
- Mounting Holes
- Schematic Diagram:
- Assembly

## Library data of the parts
C1-C20 = microbuilder:CAP_CERAMIC: Ceramic Capacitors 0402 - 0402 Surface Mount Capacitors 16pF 50V 5% [Digikey: 445-4899-2-ND] 18pF 50V 5% [Digikey: 490-1281-2-ND] 22pF 50V 5% [Digikey: 490-1283-2-ND] 68pF 50V 5% [Digikey: 490-1289-2-ND] 0.1uF 10V 10% [Digikey: 490-1318-2-ND] 1.0uF 6.3V 10% [Digikey: 490-1320-2-ND] 0603 - 0603 Surface Mount Capacitors 16 pF 50V 5% [Digikey: 445-5051-2-ND] 22 pF 50V [Digikey: PCC220ACVTR-ND] 33 pF 50V 5% [Digikey: 490-1415-1-ND] 56pF 50V 5% [Digikey: 490-1421-1-ND] 220pF 50V 5% [Digikey: 445-1285-1-ND] 680 pF 50V 2200 pF 50V 5% C0G [Digikey: 445-1297-1-ND] 5600 pF 100V 5% X7R [Digikey: 478-3711-1-ND] 0.1 µF 25V 10% [Digikey: PCC2277TR-ND] 0.22 µF 16V 10% X7R [Digikey: 445-1318-1-ND] 1.0 µF 25V 10% [Digikey: 445-5146-2-ND] 0603 - RF Specific 3pF 250V +/-0.1pF RF [Digikey: 712-1347-1-ND] 18 pF 250V 5% [Digikey: 478-3505-1-ND or 712-1322-1-ND] 56 pF 250V 5% C0G RF [Digikey: 490-4867-1-ND] 68 pF 250V RF [Digikey: 490-4868-1-ND] 0805 - 0805 Surface Mount Capacitors 220 pF 250V 2% RF Ceramic Capacitor [Digikey: 712-1398-1-ND] 1000 pF 50V 2% NP0 Ceramic Capacitor [Digikey: 478-3760-1-ND] 0.1 µF 25V 10% Ceramic Capacitor [Digikey: PCC1828TR-ND] 1.0 µF 16V 10% Ceramic Capacitor[Digikey: 490-1691-2-ND] 10.0 µF 10V 10% Ceramic Capacitor[Digikey: 709-1228-1-ND] 10.0 uF 16V 10% Ceramic Capacitor [Digikey: 478-5165-2-ND] 47 uF 6.3V 20% Ceramic Capacitor [Digikey: 587-1779-1-ND or 399-5506-1-ND] 1206 - 1206 Surface Mount Capacitors 47uF 10V 20% Ceramic Capacitor [Digikey: 490-5528-1-ND or 399-5508-1-ND or 445-6010-1-ND] 100uF 6.3V -20%, +80% Y5V Ceramic Capacitor (Digikey: 490-4512-1-ND, Mouser: 81-GRM31CF50J107ZE1L)
D1 = SparkFun-DiscreteSemi:DIODE-SCHOTTKY: Schottky diode A Schottky diode is a semiconductor diode which has a low forward voltage drop and a very fast switching action.; PROD_ID: DIO-09886; VALUE: 3A/40V/500mV
D2 = adafruit:DIODE: Diode SMADIODE - SMA Surface Mount Package 20V 1A Schottky Diode Digikey: 641-1014-6-ND DO-1N4148 - Through Hole Small Current Diode SOD-123 20V 1 A (.5mV Vf) Schottky Diode - Digikey: MBRX120TPMSCT-ND SOD-323 10V 570mA (.38mV Vf, 3ns) Schottky Diode - Digikey: ZLLS410CT-ND SOD-523 30V 30mA Schottky Diode (RB751S-40TE61) - Digikey: RB751S-40TE61CT-ND SOT23-R/W - SOT23 Package (R = Solder Paste/Reflow Ovens, W = Hand-Soldering) BAT54Film 40V 300mA - Digikey: 497-7162-1-ND
FID1-FID4 = microbuilder:FIDUCIAL: Fiducial Alignment Points Various fiducial points for machine vision alignment.; BOM: EXCLUDE
IC1 = texas:TPS5410: 1-A, WIDE INPUT RANGE, STEP-DOWN SWIFT? CONVERTER Source: U7 Texas TPS5410 Step Down Converter.pdf; MPN: TPS5410DR; OC_FARNELL: 1329596; OC_NEWARK: 18M3223
IC2 = barometer-murata:ZPA2326: Capacitive MEMS Absolute Pressure Sensor having an I2C data exchange interface
IC3 = adafruit:LP298X
JP1-JP3 = microbuilder:HEADER-1X3: PIN HEADER
L1 = inductor-tdk:INDUCTOR-TDK: Inductors Basic Inductor/Choke
PAD1-PAD6 = wirepad:SMD2: SMD PAD
Q1 = microbuilder:TRANSISTOR_NPN: NPN Transistor Transistor (NPN) 500mA 45V - BC817 [Digikey: 568-1631-1-ND] Transistor (NPN) 500mA 45V - BC817,215 [Mouser: 771-BC817-T/R] SOT23-R - SOT23 footprint optimised for use with solder paste and reflow ovens. SOT23-W - SOT23 footprint optimised for hand-soldering (larger pads).
Q2 Q3 = microbuilder:MOSFET-N: N-Channel Mosfet LEGEND VDS: Voltage Drain-Source ID: Drain Current RDS(ON): Drain-Source On-State Resistance VGS(TH): Gate-Source Threshold Voltage CISS: Drain-Source Input Capacitance SOT-23 Name VDS ID RDS(ON) VGS(TH) CISS Order Number 2N7002E 60V 260mA 2.5 Ohm 2.5V @ 250uA 26.7pF @ 25V 2N7002ET1GOSTR-ND BSH103 30V 850mA 400 mOhm 400mV @ 1mA 83pF @ 24V BSH103,235-ND BSS138 60V 320mA 1.6 Ohm 1.5V @ 250uA 50pF @ 10V Mouser: 771-BSS138PW115 DMN2075U-7 20V 4.2A 38 mOhm 1V @ 250 uA 594.3pF @ 10V DMN2075U-7DICT-ND * BSS138 good choice for I2C level-shifting
R1-R21 = microbuilder:RESISTOR: Resistors 0402 - 0402 Surface Mount Package 22 Ohm 1% 1/16W [Digikey: 311-22.0LRTR-ND] 33 Ohm 5% 1/16W 1.0K 5% 1/16W 1.5K 5% 1/16W 2.0K 1% 1/16W 10.0K 1% 1/16W [Digikey: 311-10.0KLRTR-ND] 10.0K 5% 1/16W [Digikey: RMCF0402JT10K0TR-ND] 12.1K 1% 1/16W [Digikey: 311-22.0LRTR-ND] 100.0K 5% 1/16W 0603 - 0603 Surface Mount Package 0 Ohm 1/10 Watt 1% Resistor 15 Ohm 1/10 Watt 1% Resistor 33 Ohm 1/10 Watt 1% Resistor 49.9 Ohm 1/10 Watt 1% Resistor 100 Ohm 1/10 Watt 1% Resistor 150 Ohm 1/10 Watt 1% Resistor 240 Ohm 1/10 Watt 1% Resistor 390 Ohm 1/10 Watt 1% Resistor 560 Ohm 1/10 Watt 1% Resistor 680 Ohm 1/10 Watt 1% Resistor 750 Ohm 1/10 Watt 1% Resistor 1.0K Ohm 1/10 Watt 1% Resistor 1.5K Ohm 1/10 Watt 1% Resistor 2.0K Ohm 1/10 Watt 1% Resistor 2.2K Ohm 1/10 Watt 1% Resistor 3.3K Ohm 1/10 Watt 1% Resistor 4.7K Ohm 1/10 Watt 1% Resistor 10.0K Ohm 1/10 Watt 1% Resistor 12.0K Ohm 1/10 Watt 1% Resistor 12.1K Ohm 1/10 Watt 1% Resistor 20.0K Ohm 1/10 Watt 1% Resistor 33.0K Ohm 1/10 Watt 1% Resistor 100.0K Ohm 1/10 Watt 1% Resistor 0805 - 0805 Surface Mount Package 0 Ohm 1/8 Watt 1% Resistor 33 Ohm 1/8 Watt 1% Resistor 100 Ohm 1/8 Watt 1% Resistor 150 Ohm 1/8 Watt 1% Resistor 200 Ohm 1/8 Watt 1% Resistor 240 Ohm 1/8 Watt 1% Resistor 330 Ohm 1/8 Watt 1% Resistor 390 Ohm 1/8 Watt 1% Resistor 470 Ohm 1/8 Watt 1% Resistor 1.0K Ohm 1/8 Watt 1% Resistor 1.5K Ohm 1/8 Watt 1% Resistor 2.0K Ohm 1/8 Watt 1% Resistor 4.7K Ohm 1/8 Watt 1% Resistor 5.1K Ohm 1/8 Watt 1% Resistor 5.6K Ohm 1/8 Watt 1% Resistor 10.0K Ohm 1/8 Watt 1% Resistor 22.0K Ohm 1/8 Watt 1% Resistor 33.0K Ohm 1/8 Watt 1% Resistor 100K Ohm 1/8 Watt 1% Resistor 1206 - 1206 Surface Mount Package 2012 - 2010 Surface Mount Package 0.11 Ohm 1/2 Watt 1% Resistor - Digikey: RHM.11UCT-ND
SJ1-SJ3 SJ6-SJ12 = SparkFun-Retired-0:SOLDERJUMPER: Solder Jumper Standard SMD solder jumper. Used to automate production. Two varients : Normally Open and Normally Closed are the same, but have different paste layers. NC will have a large amount of paste and should jumper during reflow.
TP1-TP19 = testpad:PTR1: TEST PIN
U1 = LTC_By_element14_Batch_1:LTC2850IS8PBF: 3.3V 20Mbps RS485/RS422 Transceivers; MPN: LTC2850IS8#PBF; OC_FARNELL: 1663700; OC_NEWARK: 56M6384; PACKAGE: SOIC-8; SUPPLIER: Linear Technology
U2 = v-shifter-sparkfun:PCA9306: Bidirectional I2C level shifter Not compatible with all available part number pinout schemes- DOUBLE CHECK!!! Datasheet <https://cdn.sparkfun.com/datasheets/BreakoutBoards/PCA9306DC.pdf> SparkFun Products SparkFun Inventor's Kit for RedBot <https://www.sparkfun.com/products/12649> (ROB-12649) SparkFun RedBot Basic Kit <https://www.sparkfun.com/products/13166> (ROB-13166) SparkFun Level Translator Breakout - PCA9306 <https://www.sparkfun.com/products/11955> (BOB-11955) SparkFun Block for Intel Edison - ADC <https://www.sparkfun.com/products/13770> (DEV-13770) SparkFun Block for Intel® Edison - Raspberry Pi B <https://www.sparkfun.com/products/13044> (DEV-13044) SparkFun RedBot Sensor - Accelerometer <https://www.sparkfun.com/products/12589> (SEN-12589); PROD_ID: IC-10023
U3 = texas-msp:DAC8574: The DAC8574 is a low-power, quad channel, 16-bit buffered voltage output DAC. Its on-chip precision output amplifier allows rail-to-rail output swing to be achieved. The DAC8574 utilizes an I2C compatible two wire serial interface supporting high-speed interface mode with address support of up to sixteen DAC8574s for a total of 64 channels on the bus.
U4 = transceiver-burrbrown:TRANSCEIVER-XTR117
U5 = v-regulator-torex:XC6215: XC6215 Series: 0.8 uA Low Power Consumption Voltage Regulator with ON/OFF Switch
U6 = texas-msp:MAX3221
U7 = SparkFun-Retired-0:ATTINY45: Atmel 8-pin 2/4/8kB flash uC Retired; PROD_ID: IC-09092
U$1-U$4 = microbuilder:MOUNTINGHOLE: Mounting Hole For #2 screws (0.086"/2.18mm width, 0.094"/2.4mm hole) use 2.5mm
X1 = con-phoenix-350:1751248: MKDS 1/ 2-3,5 Printklemme Nennstrom: 10 A Bemessungsspannung: 160 V Raster: 3,5 mm Polzahl: 2 Montageart: Löten Anschlussart: Schraubanschluss Anschlussrichtung vom Leiter zur Platine: 0° Source: http://eshop.phoenixcontact.com .. 1751248.pdf; OC_FARNELL: unknown; OC_NEWARK: unknown
X2 = con-phoenix-350:1751264: MKDS 1/ 4-3,5 Printklemme Nennstrom: 10 A Bemessungsspannung: 160 V Raster: 3,5 mm Polzahl: 4 Montageart: Löten Anschlussart: Schraubanschluss Anschlussrichtung vom Leiter zur Platine: 0° Source: http://eshop.phoenixcontact.com .. 1751264.pdf; MPN: 1751264; OC_FARNELL: unknown; OC_NEWARK: 10R0934

## Net classes
1 power: width 0.305 mm

## Board
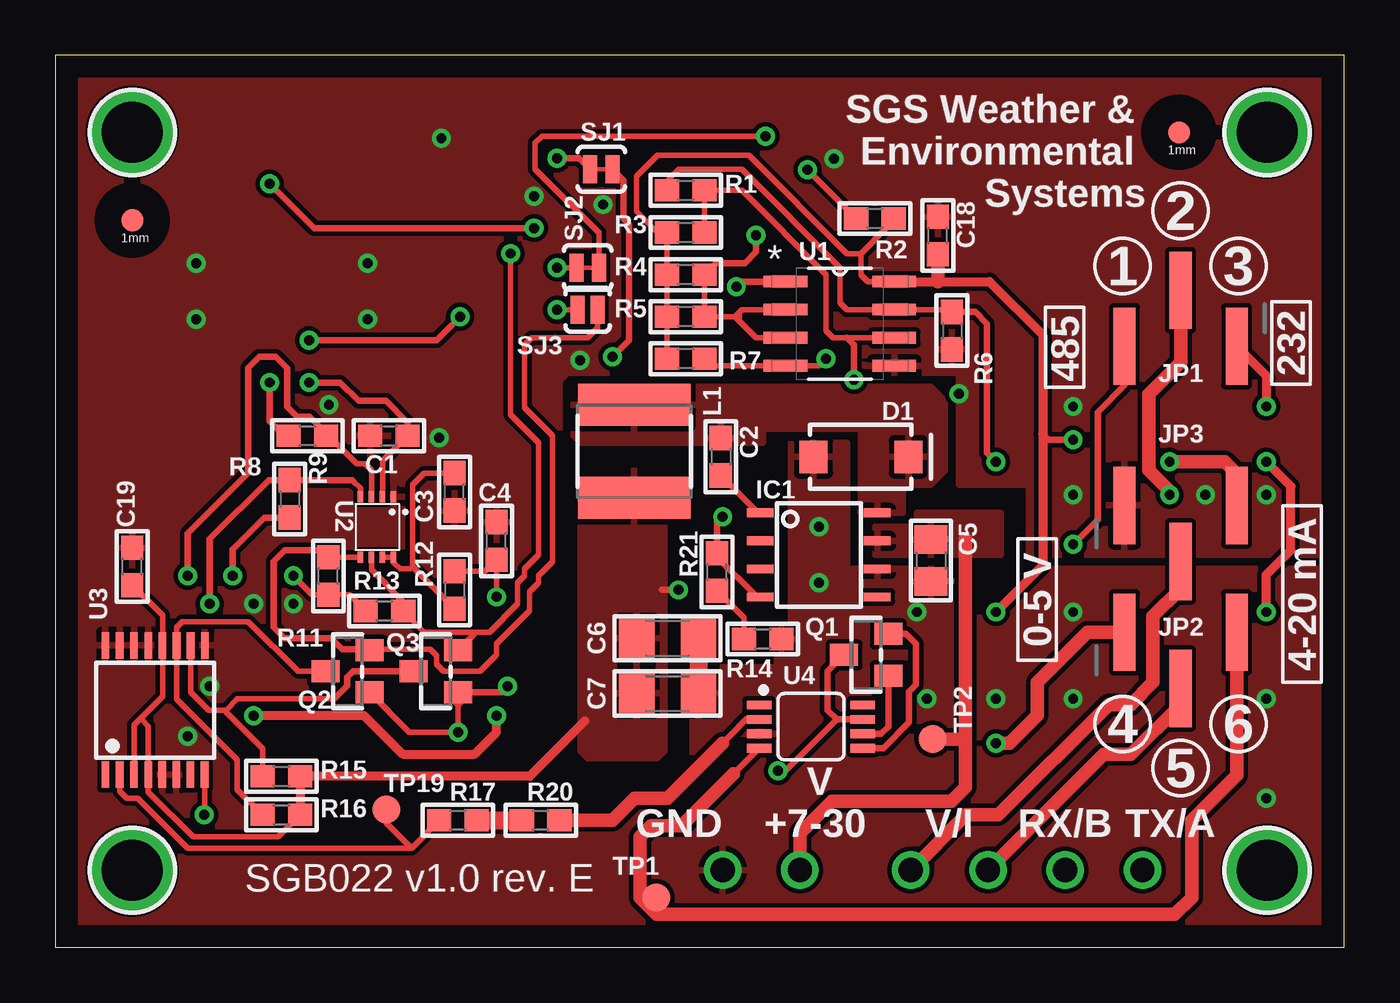
[diagram p9: board, top side]
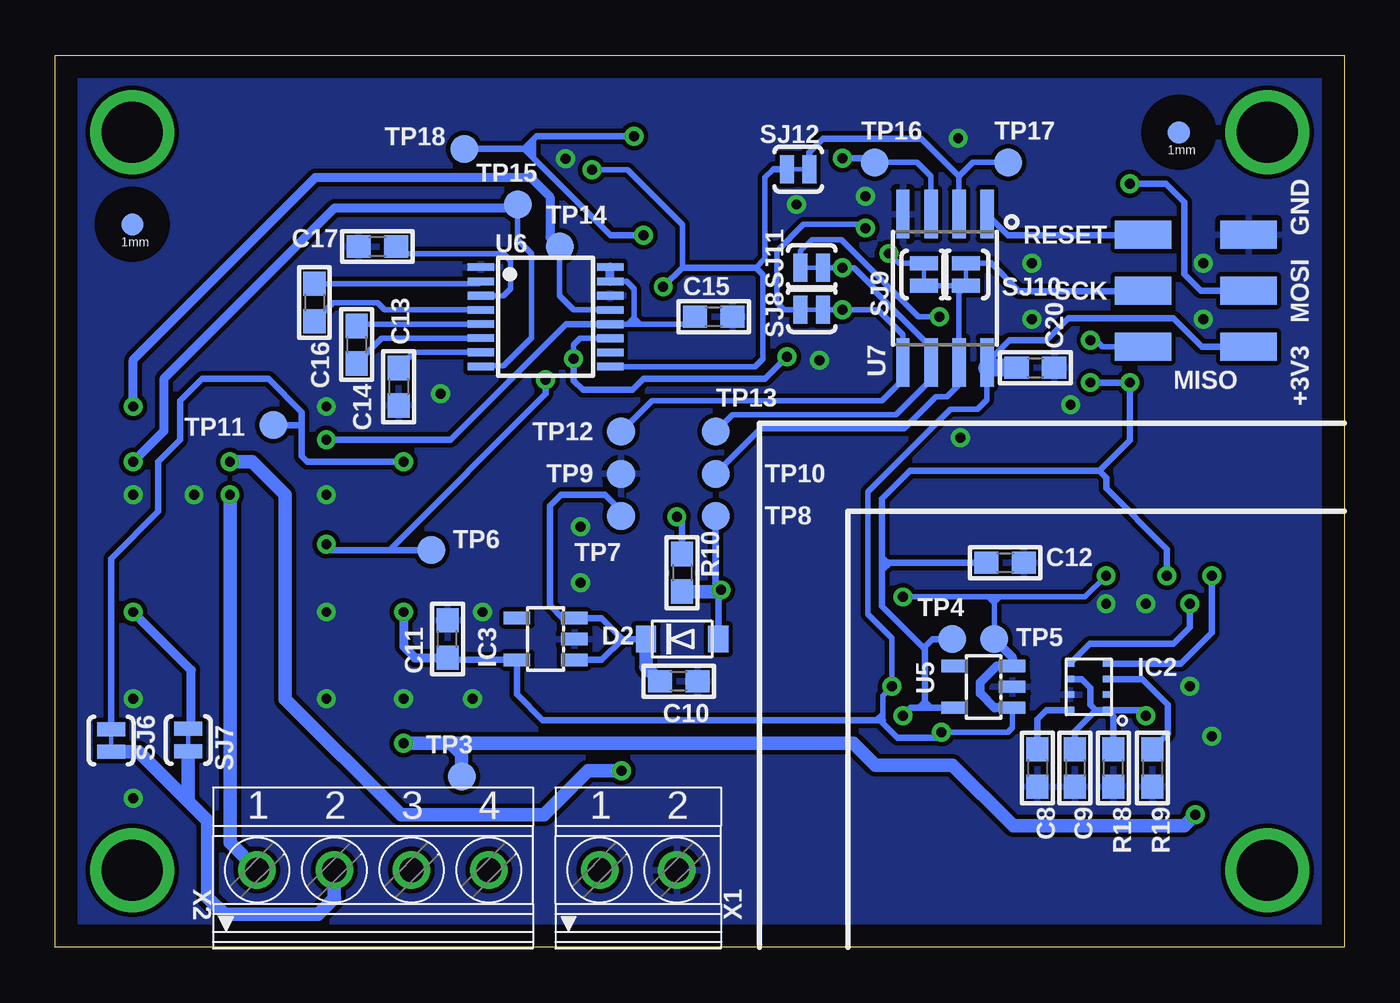
[diagram p10: board, bottom side, seen from below]

Size 58.42 x 40.41 mm. Coordinates in mm from the lower left corner, seen from the top.
Outline: 0,0 58.42,0 58.42,40.41 0,40.41 0,0
Copper layers (1*16): Top 0.035mm / dielectric 1.5mm / Bottom 0.035mm
Design rules "default": minimum track width 10mil, minimum drill 24mil, track to track 8mil, track to pad 8mil, pad to pad 8mil, via to via 8mil, smd to smd 8mil, copper to edge 40mil, drill to drill 8mil, minimum pad ring 10mil, minimum via ring 8mil, stop-mask expansion 4mil, vias tented up to drill 0mil, thermal gap 10mil

### Footprints (pad centres in the part's own frame; a part is rotated, then mirrored left to right if it is on the bottom)
0603 = smd 1.1 x 1: 1 -0.85,0; 2 0.85,0
0805 = smd 1.3 x 1.5: 1 -0.95,0; 2 0.95,0
1206 = smd 1.6 x 1.8: 1 -1.4,0; 2 1.4,0
SMA-DIODE = smd 1.27 x 1.47: A -2.15,0; C 2.15,0
SOD-123FL = smd 0.91 x 1.22: A 1.637,0; C -1.637,0
FIDUCIAL-1X2.5 = smd 1 x 1: 1 0,0
D_R-PDSO-G08 = smd 0.4 x 1.2: 1 -1.905,-2.65; 2 -0.635,-2.65; 3 0.635,-2.65; 4 1.905,-2.65; 5 1.905,2.65; 6 0.635,2.65; 7 -0.635,2.65; 8 -1.905,2.65
2326 = smd 0.4 x 0.3: 1 -0.85,1.05; 2 -0.85,0.35; 3 -0.85,-0.35; 4 -0.85,-1.05; 5 0.85,-1.05; 6 0.85,-0.35; 7 0.85,0.35; 8 0.85,1.05
SOT23-5L = smd 0.55 x 1.2: 1 -0.95,-1.3; 2 0,-1.3; 3 0.95,-1.3; 4 0.95,1.3; 5 -0.95,1.3
1X03_SMT = smd 1 x 3.5: 1 -2.54,1.27; 2 0,-1.27; 3 2.54,1.27
VLS6045EX = smd 1.9 x 5.1: 1 -2.1,0; 2 2.1,0
SMD1,27-2,54 = smd 1.27 x 2.54: 1 0,0
SOT23-WIDE = smd 1 x 1.27: 1 -0.95,-1; 2 0.95,-1; 3 0,1
SJ_2S-TRACE = smd 0.635 x 1.27: 1 -0.508,0; 2 0.508,0
SJ_2S-NO = smd 0.635 x 1.27: 1 -0.45,0; 2 0.45,0
B1,27 = smd 1.27 x 1.27: TP 0,0
SOIC127P600X175-8N = smd 1.981 x 0.533: 1 -2.464,1.905; 2 -2.464,0.635; 3 -2.464,-0.635; 4 -2.464,-1.905; 5 2.464,-1.905; 6 2.464,-0.635; 7 2.464,0.635; 8 2.464,1.905
PSOP-8 = smd 0.25 x 0.5: 1 -0.73,-1.37; 2 -0.23,-1.37; 3 0.27,-1.37; 4 0.77,-1.37; 5 0.77,1.38; 6 0.27,1.38; 7 -0.23,1.38; 8 -0.73,1.38
TSSOP16 = smd 0.35 x 1.2: 1 -0.975,-2.925; 2 -0.325,-2.925; 3 0.325,-2.925; 4 0.975,-2.925; 5 1.605,-2.925; 6 2.245,-2.925; 7 2.885,-2.925; 8 3.525,-2.925; 9 3.535,2.925; 10 2.895,2.925; 11 2.255,2.925; 12 1.615,2.925; 13 0.975,2.925; 14 0.325,2.925; 15 -0.325,2.925; 16 -0.975,2.925
MSOP8-0.65-3X3MM = smd 1.1 x 0.4: 1 -2.35,0.975; 2 -2.35,0.325; 3 -2.35,-0.325; 4 -2.35,-0.975; 5 2.35,-0.975; 6 2.35,-0.325; 7 2.35,0.325; 8 2.35,0.975
SOT25 = smd 0.55 x 1.2: 1 -0.95,-1.3; 2 0,-1.3; 3 0.95,-1.3; 4 0.95,1.3; 5 -0.95,1.3
SO08-EIAJ_MCU = smd 0.61 x 2.21: 1 -1.905,-3.378; 2 -0.635,-3.378; 3 0.635,-3.378; 4 1.905,-3.378; 5 1.905,3.353; 6 0.635,3.353; 7 -0.635,3.353; 8 -1.905,3.353
MOUNTINGHOLE_2.75_PLATED = drill 2.75 pad 3.81: P$1 0,0
1751248 = drill 1.1 pad 1.7: 1 -1.75,-0.1; 2 1.75,-0.1
1751264 = drill 1.1 pad 1.7: 1 -5.25,-0.1; 2 -1.75,-0.1; 3 1.75,-0.1; 4 5.25,-0.1

### Placement (x,y rotation side)
C1  15.12,23.18 0 top
C2  30.16,22.22 270 top
C3  18.1,20.64 90 top
C4  20,18.41 90 top
C5  39.69,17.53 270 top
C6  27.75,14 0 top
C7  27.75,11.5 0 top
C8  13.91,8.13 270 bottom
C9  12.21,8.13 270 bottom
C10  30.16,12.06 0 bottom
C11  40.64,13.97 90 bottom
C12  15.38,17.43 0 bottom
C13  42.86,25.4 270 bottom
C14  44.77,27.3 270 bottom
C15  28.57,28.57 0 bottom
C16  46.67,29.21 270 bottom
C17  43.81,31.75 180 bottom
C18  40,32.25 90 top
C19  3.5,17.25 90 top
C20  14,26.25 0 bottom
D1  36.51,22.22 0 top
D2  30.01,13.97 0 bottom
FID1  50.93,36.92 0 top
FID2  3.49,32.94 0 top
FID3  7.5,36.92 0 bottom
FID4  54.93,32.75 0 bottom
IC1  34.61,17.78 270 top
IC2  11.59,11.8 180 bottom
IC3  36.2,13.97 90 bottom
JP1  51,28.5 180 top
JP2  51,13 0 top
JP3  51,18.75 0 top
L1  26.24,22.47 270 top
PAD1  9.12,27.21 270 bottom
PAD2  4.34,27.21 270 bottom
PAD3  9.12,29.75 270 bottom
PAD4  4.34,29.75 270 bottom
PAD5  9.12,32.29 270 bottom
PAD6  4.34,32.29 270 bottom
Q1  36.75,13.25 90 top
Q2  13.25,12.5 90 top
Q3  17.25,12.5 90 top
R1  28.57,34.29 0 top
R2  37.15,33.02 0 top
R3  28.57,32.38 180 top
R4  28.57,30.48 180 top
R5  28.57,28.57 180 top
R6  40.64,27.94 270 top
R7  28.57,26.67 180 top
R8  11.43,23.18 180 top
R9  10.63,20.32 270 top
R10  30.01,16.97 270 bottom
R11  12.38,16.82 90 top
R12  18.1,16.19 270 top
R13  14.92,15.24 0 top
R14  32.07,13.97 180 top
R15  10.25,7.75 0 top
R16  10.25,6 0 top
R17  18.25,5.75 180 top
R18  10.46,8.13 90 bottom
R19  8.71,8.13 270 bottom
R20  22,5.75 180 top
R21  30,17 90 top
SJ1  24.75,35.25 0 top
SJ2  24.13,30.8 0 top
SJ3  24.13,28.89 0 top
SJ6  55.89,9.37 90 bottom
SJ7  52.39,9.39 90 bottom
SJ8  24.13,28.89 180 bottom
SJ9  19.05,30.48 90 bottom
SJ10  17.14,30.48 90 bottom
SJ11  24.13,30.8 180 bottom
SJ12  24.75,35.25 180 bottom
TP1  27.25,2.25 0 top
TP2  39.76,9.43 0 top
TP3  40,7.75 0 bottom
TP4  17.77,13.97 0 bottom
TP5  15.87,13.97 0 bottom
TP6  41.36,18 0 bottom
TP7  32.78,19.55 0 bottom
TP8  28.49,19.55 0 bottom
TP9  32.78,21.45 0 bottom
TP10  28.49,21.45 0 bottom
TP11  48.52,23.66 0 bottom
TP12  32.78,23.36 0 bottom
TP13  28.49,23.36 0 bottom
TP14  35.56,31.75 0 bottom
TP15  37.47,33.65 0 bottom
TP16  21.27,35.56 0 bottom
TP17  15.24,35.56 0 bottom
TP18  39.88,36.17 0 bottom
TP19  15,6.25 0 top
U1  35.56,28.25 0 top
U2  14.61,19.05 180 top
U3  3.25,10.75 0 top
U4  34.25,10 0 top
U5  16.35,11.8 90 bottom
U6  36.2,29.84 270 bottom
U7  18.1,29.84 180 bottom
U$1  3.49,36.92 0 top
U$2  54.93,36.92 0 top
U$3  3.49,3.49 0 top
U$4  54.93,3.49 0 top
X1  32,3.6 0 bottom
X2  44.02,3.6 0 bottom

### Tracks (layer width: path | path; a pad name or v marks a point on that pad's centre or on a via)
485EN  (via drill 0.45)
  Top 0.152: 31,28.75 31.11,28.86 31.11,28.89
  Top 0.254: R4.1 R5.1 30.8,28.57 | U1.3 31.75,27.62 30.8,28.57 | U1.2 31.11,28.89 30.8,28.57 | SJ2.2 24.64,32.36 21.75,35.25 21.75,36.44 22.06,36.75 v32.19,36.75 | 31,28.4 31,28.75
  Top 0.305: v31.75,32.25 31.75,31.5 31.25,31 29.95,31 R4.1
  Bottom 0.254: 37,36 37,36.25 | 36.75,36.5 36.75,35.75
  Bottom 0.305: 37.17,36.17 37,36 36.75,35.75 33.25,32.25 v31.75,32.25 | 37.17,36.17 TP18.TP | v32.19,36.75 36.59,36.75 37.17,36.17
+1V8  (via drill 0.45)
  Top 0.254: R8.2 10.48,23.07 | U2.2 14.84,22.04 C1.2
  Top 0.305: v8.04,16.82 8.04,18.05 9.47,19.47 R9.2 | 10.48,23.07 9.73,23.82 v9.73,25.59 | v11.5,25.59 12.91,25.59 13.75,24.75 15,24.75 15.97,23.77 C1.2
  Top 0.406: v9,10.5 14,10.5 15.75,8.75 19,8.75 20,9.75 v20,10.5
  Bottom 0.254: 10.79,21.27 11.11,21.59 | 20.88,17.12 20.62,17.38 20.88,17.62 20.88,17.43
  Bottom 0.305: 20.95,17.5 20.95,20.32 19.68,21.59 11.11,21.59 9.73,22.97 v9.73,25.59 v11.5,25.59 | IC2.1 11.25,10.75 | 11.25,10.75 11.5,11 11.5,11.75 11.9,12.15 IC2.6 | IC2.1 10.46,10.47 R18.2 | C9.1 12.21,9.79 11.25,10.75 | v9,10.5 9.25,10.75 IC2.1 | 10.79,21.27 10.79,20.8 8.04,18.05 v8.04,16.82 | U5.5 19,10.85 | TP4.TP 18.66,13.97 19,13.62 | 19,13.62 19,11.12 | 19,11.12 19,10.85 | 19,11.12 18.75,10.88 | 19,11.12 19.25,10.88 | 20.95,17.5 20.95,15.46 19.12,13.62 19,13.62 | 19,10.85 19.66,10.85 v20,10.5 | C12.1 20.88,17.43 20.95,17.5
+3V3  (via drill 0.45)
  Top 0.254: R13.1 13.34,15.97 R11.1 11.64,15.97 v10.79,16.82 | R12.1 19.48,17.04 C4.1 v20,15.87 | Q3.1 18.25,11 | 18.25,11 v18.25,9.75 16.05,9.75 Q2.1 | 18.25,11 18.5,11.25 | 18.25,11 18,11.25 | R7.2 R5.2 R4.2 R3.2 27.3,32.38 26.35,33.34 26.35,34.92 27.3,35.88 31.43,35.88 35.88,31.43 36.51,31.43 | R2.2 37.68,32.6 36.51,31.43 | 36.51,31.43 36.51,30.48 36.83,30.16 U1.8
  Top 0.305: v46.13,23 45,23 44.75,23.25 | v20.5,11.82 20.23,11.55 Q3.1
  Top 0.406: U1.8 40,30.16 42.34,30.16 44.75,27.75 44.75,23.25 44.75,17.31 v42.63,15.19
  Top 0.61: C18.1 40,30.16
  Bottom 0.152: 31.94,28.25 31.96,28.23 32.19,28.23
  Bottom 0.254: v20,15.87 16,15.87 | 16,15.87 15.88,15.87 | 15.88,15.87 11.75,15.87 v10.79,16.82 | U5.1 15.05,9.95 15.25,9.75 v18.25,9.75 | TP5.TP 15.87,15.74 16,15.87 | 15.88,15.62 15.62,15.88 | 15.88,15.87 15.88,15.62 | 15.88,15.62 16.12,15.88 | U7.8 16.19,26.25 16.19,24.81 16.62,24.38 17.85,24.38 21.59,20.64 21.59,15.09 20.5,14 v20.5,11.82 20.92,11.4 20.92,10.29 | 21.12,10.38 21,10.5 21,10.38 | C15.1 29.77,28.23 32.19,28.23 | 32.19,28.23 U6.12 | U6.15 32.52,30.17 32.19,29.84 32.19,28.23 | 31.94,28.25 32.19,28.5 32.44,28.25
  Bottom 0.305: C11.1 40.54,13.02 IC3.5 37.49,11.46 36.33,10.29 20.92,10.29 | PAD2.1 6.46,27.21 7.75,28.5 12.5,28.5 13.5,27.5 15.18,27.5 U7.8 | U6.12 35.27,28.23 40.5,23 v46.13,23 | v18.25,9.75 18.5,9.5 20.25,9.5 21,10.25 21,10.38
  Bottom 0.406: TP5.TP 15.05,13.15 U5.3 15.75,12.75 16.5,12 16.5,11.5 15.85,10.85 U5.1 | U6.15 U6.16 | v42.63,15.19 42.63,13.63 42.12,13.12 C11.1
  Bottom 0.813: C20.1 16.19,26.25
+5V0  (via drill 0.45)
  Top 0.254: U3.3 3.58,10.07 3.88,10.38 | 3.88,10.38 4.87,11.37 U3.12 4.87,15.04 C19.1 | 3.88,10.38 4.22,10.03 U3.4 4.22,7.03 6.25,5 10.1,5 R16.2
  Top 0.305: v28.25,16.19 27.5,16.19
  Top 0.406: 24,10.25 21.5,7.75 R15.2 R16.2
  Bottom 0.305: D2.A 28.37,16.07 v28.25,16.19 28.49,16.43 TP8.TP
  Bottom 0.61: R10.2 28.32,16.12 v28.25,16.19
  pour Top: 27.62,21.59 27.62,8.89 27.3,8.57 24.13,8.57 23.81,8.89 23.81,21.59
A  (via drill 0.45)
  Top 0.254: R3.1 R1.2 31.11,34.29 34.92,30.48 34.92,27.94 35.24,27.62 35.88,27.62 U1.6
  Top 0.305: v36.2,25.71 36.2,27.3 35.88,27.62 | v46.13,18.25 47.25,19.37 47.25,24.25 48.46,25.46 JP1.3
  Bottom 0.305: 43.27,18 36.2,25.08 v36.2,25.71 | TP6.TP 43.27,18 | 43.27,18 45.88,18 v46.13,18.25
A-OUT-1
  Top 0.61: X2.3 47.52,8.75 48.75,8.75 51,11 JP2.2
A-OUT-2
  Top 0.61: X2.4 41.27,6 42.75,6 47.75,11 48.75,11 49.75,12 49.75,15 51,16.25 JP3.2
B  (via drill 0.45)
  Top 0.254: R1.1 27.73,34.71 28.26,35.24 31.11,35.24 35.56,30.8 35.56,29.21 35.88,28.89 U1.7 40.54,28.89 R6.1
  Top 0.305: R6.1 41.7,28.79 42.23,28.25 42.23,22.4 v42.63,22
  Bottom 0.305: v42.63,22 47,22 47.25,22.25 47.25,23.75 | 47.25,23.75 47.25,24.25 48.75,25.75 51.75,25.75 52.75,24.75 52.75,23 53.75,22 53.75,19.75 55.89,17.61 SJ6.2 | TP11.TP 47.34,23.66 47.25,23.75
B0  (via drill 0.45)
  Top 0.254: SJ3.1 v22.75,28.89
  Bottom 0.254: TP12.TP 31.37,24.76 20.95,24.76 20,25.71 U7.5 20,27.75 21.14,28.89 v22.75,28.89 SJ8.1
B1  (via drill 0.45)
  Top 0.254: SJ2.1 v22.75,30.8
  Bottom 0.254: TP13.TP 27.72,24.13 20.32,24.13 18.73,25.72 U7.6 18.73,27.18 21.25,29.7 21.25,29.82 22.23,30.8 v22.75,30.8 SJ2.1
B2
  Bottom 0.254: SJ9.1 SJ10.1 17.46,29.65 U7.7 17.5,26.45 17.5,25.45 18,24.95 18.5,24.95 19.96,23.49 26.45,23.49 TP10.TP
B3
  Bottom 0.254: TP17.TP 16.83,35.56 17.46,34.92 U7.2
  Bottom 0.305: SJ12.1 24.24,36.01 23.62,36.62 19.16,36.62 17.46,34.92
B4  (via drill 0.45)
  Top 0.305: SJ1.1 23.74,35.75 v22.75,35.75
  Bottom 0.254: U7.3 18.73,34.92 19.37,35.56 TP16.TP
  Bottom 0.305: v22.75,35.75 21.46,35.75 TP16.TP
BASE
  Top 0.305: Q1.1 37.75,10 37.42,9.68 U4.6
BOOT
  Top 0.305: C2.2 31.85,19.68 IC1.1
C1+
  Bottom 0.254: C16.1 39.23,30.06 U6.2
C1-
  Bottom 0.254: C16.2 45.82,29.21 43.81,29.21 43.5,28.89 39.14,28.89 U6.4
C2+
  Bottom 0.254: C14.1 44.68,28.24 U6.5
C2-
  Bottom 0.254: C14.2 43.62,27.6 U6.6
COLLECTOR  (via drill 0.45)
  Top 0.305: Q1.3 35,12.5 35,10.75 35.42,10.32 | 35.42,10.32 U4.7 | v32.75,8 33.1,8 35.42,10.32
  Top 0.61: JP3.3 53.54,21.46 53,22 v50.5,22
  Bottom 0.61: v32.75,8 34.27,8 36.27,6 42.75,6 48,11.25 48,20.5 49.5,22 v50.5,22
D-OUT-1
  Bottom 0.61: 52.39,6.62 SJ7.1 | SJ6.1 54.63,8.86 52.39,6.62 | 52.39,6.62 51.5,5.73 51.5,2.25 50.75,1.5 46.5,1.5 45.75,2.25 45.77,2.27 X2.2
D-OUT-2  (via drill 0.45)
  Top 0.61: JP1.2 51,26.5 49.56,25.06 49.56,21.61 50.5,20.68 v50.5,20.51
  Bottom 0.61: X2.1 50.5,4.73 v50.5,20.51
DIN  (via drill 0.45)
  Top 0.254: R7.1 29.74,26.35 U1.4 34.61,26.35 v34.92,26.67
  Top 0.305: SJ1.2 25.75,34.76 25.75,33 26,32.75 26,27.5 v25.25,26.75
  Bottom 0.254: U6.11 34.64,27.59 34.92,27.3 v34.92,26.67
  Bottom 0.305: v25.25,26.75 26.25,25.75 31.75,25.75 32.25,25.25 34.5,25.25 34.92,25.68 v34.92,26.67
DOUT  (via drill 0.45)
  Top 0.406: JP1.1 54.88,25.89 v54.88,24.5
  Bottom 0.254: TP14.TP 35.56,29.52 34.92,28.89 33.29,28.89 U6.13
  Bottom 0.406: TP14.TP 36,32.19 36,34 36.88,34.88 46.62,34.88 54.88,26.62 v54.88,24.5
EMITTER
  Top 0.305: Q1.2 38.55,14.2 39,13.75 39,11.9 38.69,11.59 38.69,10.19 37.52,9.03 U4.5
GND  (via drill 0.45)
  Top 0.813: C6.2 C7.2
  other vias: 14.15,28.46 34.61,16.51 34.61,19.05 39.05,15.19 39.5,11.25 40.96,25.08 21.7,34.02 23.79,26.6 6,9.57 10.79,15.57 14.15,31 6.39,28.46 6.39,31 42.63,11.25 17.5,36.65 46.13,20.51 54.88,20.51 46.13,15.19 46.13,11.25 54.88,11.25 24.82,33.65 35.29,35.73 9,15.57 12.4,24.58 17.4,23.08 54.88,6.75 7,11.82 46.13,24.5 52.13,20.51
  pour Bottom: 0,40.41 58.42,40.41 58.42,0 0,0
  pour Top: 28.89,12.7 32.7,12.7 32.7,14.6 33.34,14.6 33.34,22.86 35.88,22.86 35.88,17.14 58.42,17.14 58.42,0 0,0 0,40.41 58.42,40.41 58.42,17.78 44.13,17.78 44.13,20.95 40.96,20.95 40.96,26.03 23.25,26.03 22.86,25.65 22.86,8.25 23.5,7.62 27.94,7.62 28.89,8.57
I-IN
  Top 0.305: 30.25,9.25 30.99,9.99 30.99,10.02 31.3,10.32 U4.2
  Top 0.61: R20.1 25.25,5.75 26.25,6.75 27.75,6.75 30.25,9.25
I-OUT
  Top 0.305: 30.75,7.88 U4.4
  Top 0.61: 26.5,2.25 27.25,1.5 50.75,1.5 51.5,2.25 51.5,5.75 53.54,7.79 JP2.3 | 30.75,7.88 28.38,5.5 27,5.5 26.5,5 26.5,2.25 | 26.5,2.25 TP1.TP
MEZZANINE-1
  Top 0.813: R17.1 R20.2
MISO  (via drill 0.45)
  Top 0.305: v18.35,28.57 17.28,27.5 v11.5,27.5
  Bottom 0.254: v18.35,28.57 19.3,28.57 22.79,32.06 24.13,32.06 24.64,31.56 SJ11.2 | PAD1.1 10.96,27.21 11.25,27.5 v11.5,27.5
MOSI  (via drill 0.45)
  Top 0.305: v9.73,34.59 11.73,32.59 v21.7,32.59
  Bottom 0.254: SJ8.2 25.4,28.89 25.72,29.21 25.72,31.53 24.5,32.75 21.86,32.75 v21.7,32.59
  Bottom 0.305: PAD4.1 6.5,29.75 7.25,30.5 7.25,33.75 8.09,34.59 v9.73,34.59
N$1
  Top 0.254: R14.2 31.22,14.93 R21.1
PH
  pour Top: 32.07,22.86 23.81,22.86 23.5,23.18 23.5,25.08 23.81,25.4 39.69,25.4 40.32,24.76 40.32,21.59 39.69,20.95 38.42,20.95 38.42,19.68 36.51,19.68 36.51,23.49 32.07,23.49
RESET
  Bottom 0.305: PAD5.1 9.14,32.27 15.24,32.27 U7.1
RIN  (via drill 0.45)
  Top 0.406: v54.88,15.19 54.88,16.87 56,17.99 56,20.88 v54.88,22
  Bottom 0.254: TP15.TP 37.47,32.06 36.83,31.43 36.83,27.62 38.1,26.35 39.09,26.35 U6.8
  Bottom 0.305: 37.62,33.5 TP15.TP
  Bottom 0.406: 37.62,33.5 45.75,33.5 53.5,25.75 53.5,23.38 v54.88,22 | SJ7.2 52.25,10.03 52.25,12.56 v54.88,15.19
ROUT  (via drill 0.45)
  Top 0.254: v34.09,35.23 R2.1
  Top 0.305: U1.1 31.11,30.16 v30.86,29.92
  Bottom 0.254: U6.9 26.71,26.31 26.35,26.67 26.35,30.48 26.67,30.8 26.25,31.21 26.25,34.88 25.88,35.25 | 29.99,30.8 29.99,32.74 32.48,35.23 v34.09,35.23
  Bottom 0.305: SJ12.2 25.88,35.25 | 26.67,30.8 29.99,30.8 v30.86,29.92
SA0
  Bottom 0.305: IC2.3 9.15,12.15 8,11 8,9.68 R19.1
SCK
  Bottom 0.254: SJ10.2 16,30.98
  Bottom 0.305: PAD3.1 9.14,29.73 14.74,29.73 16,30.98
SCL_1V8  (via drill 0.45)
  Top 0.254: R8.1 12.38,23.18 13.65,21.91 14.04,21.91 14.34,21.61 U2.3
  Top 0.305: v6,16.82 6,18.75 8.75,21.5 8.75,26.25 9.25,26.75 10,26.75 10.51,26.24 10.51,24.49 10.97,24.03 11.53,24.03 12.38,23.18
  Bottom 0.305: IC2.4 7.4,12.85 6,14.25 v6,16.82
SCL_3V3  (via drill 0.45)
  Top 0.254: 19,14.29 19.68,14.29 20.95,15.55 20.95,16.51 21.27,16.82 21.27,17.14 21.91,17.78 21.91,22.86 20.64,24.13 v20.64,31.43 | 19,14.29 16.73,14.29 R13.2 15.77,15.66 14.34,17.09 U2.6 | Q3.2 19,14.2 19,14.29
  Bottom 0.254: SJ9.2 20.19,30.98 v20.64,31.43
SCL_5V0
  Top 0.254: R15.1 9.4,9 7.75,10.65 7.75,10.75 | 12.89,11.5 12.65,11.26 8.26,11.26 7.75,10.75 | U3.10 6.14,11.57 6.96,10.75 7.75,10.75
  Top 0.305: 12.89,11.5 13.24,11.85 13.24,12.24 13.5,12.5 Q3.3
SDA_1V8  (via drill 0.45)
  Top 0.254: U2.4 13.84,20.79 13.5,21.12
  Top 0.305: v7,15.57 7,18.5 9.67,21.17 R9.1 13.46,21.17 13.5,21.12
  Bottom 0.305: IC2.5 11.54,13.75 7.75,13.75 7,14.5 v7,15.57
SDA_3V3
  Top 0.254: U2.5 12.39,17.67 R11.2 | Q2.2 14.3,13.5 17,13.5 17.29,13.21 17.29,12.81 17.6,12.5 19.25,12.5 20,13.25 20,13.75 21.5,15.25 21.5,16.1 21.91,16.51 21.91,16.82 22.54,17.46 22.54,23.18 21.27,24.45 21.27,27.3 21.59,27.62 24.13,27.62 24.58,28.07 SJ3.2
  Top 0.305: R11.2 12.06,18 10.4,18 9.9,17.5 9.9,14.5 10.4,14 12.5,14 13,13.5 14.3,13.5
SDA_5V0
  Top 0.254: Q2.3 11,12.5 8.75,14.75 5.75,14.75 5.5,14.51 U3.11 5.5,11.24 8.25,8.5 8.25,7.15 R16.1
V+
  Bottom 0.254: U6.3 38.11,29.52 37.78,29.84 37.78,31.11 38.1,31.43 42.65,31.43 C17.1
V-
  Bottom 0.254: C13.1 42.15,26.96 U6.7
V-OUT-1  (via drill 0.45)
  Top 0.254: v6.75,6 6.78,6.03 U3.8
  Top 0.61: v42.63,9.25 43.23,9.25 44.5,10.52 44.5,12 46.77,14.27 JP2.1
  Bottom 0.61: v42.63,9.25 40.5,9.25 | TP3.TP 40,8.75 40.5,9.25 | 40.5,9.25 22.25,9.25 21.25,8.25 17.75,8.25 15,5.5 7.25,5.5 v6.75,6
V-OUT-2
  Top 0.254: U3.2 2.92,7.08 3.25,6.75 3.75,6.75 6,4.5 16.15,4.5 | 16.15,4.5 R17.2 | TP19.TP 15,5.65 16.15,4.5
VIN
  Top 0.61: 41.25,9.5 41.25,7.25 40.62,6.62 35.19,6.62 33.75,5.18 X1.1 | 41.25,9.5 41.25,18.5 | TP2.TP 41.18,9.43 41.25,9.5
  pour Top: 37.15,19.05 39.05,19.05 39.05,19.68 42.86,19.68 42.86,17.78 37.15,17.78
VIN_5V0
  Bottom 0.305: 32.7,13.97 33.65,14.92 IC3.3 35.42,14.92 36,15.5 36,20 35.5,20.5 33.5,20.5 32.78,19.78 TP7.TP | IC3.1 33.65,13.02 32.7,13.97 | D2.C 32.7,13.97
  Bottom 0.61: C10.1 31.64,12.7 D2.C
VREF
  Bottom 0.305: IC2.8 13.5,10.75 13.91,10.34 C8.1
VREF_3V3
  Top 0.254: C3.2 16.73,21.48 16.19,20.95 16.19,17.25 | 16.19,17.25 R12.2 | 16.19,17.25 16.09,17.14 15.62,17.14 15.34,17.43 U2.8 U2.7
VSENSE  (via drill 0.45)
  Top 0.254: 31.81,15.87 30,17.68 R21.2
  Top 0.305: IC1.4 31.81,15.87 | R21.2 30,19.25 v30.25,19.5
  Bottom 0.305: R10.1 30.01,19.26 v30.25,19.5

### Text on the board
tNames: SGS Weather & / Environmental / Systems | 2 | 1 | 3 | 485 | 232 | 0-5 V | 4-20 mA | 4 | 6 | 5 | GND | V / +7-30 | V/I | RX/B | TX/A | SGB022 v1.0 rev. E
bNames: GND | RESET | MOSI | SCK | +3V3 | MISO